# Altium project Mixed Signal Design Board.PrjPcb (part 1 of 2)
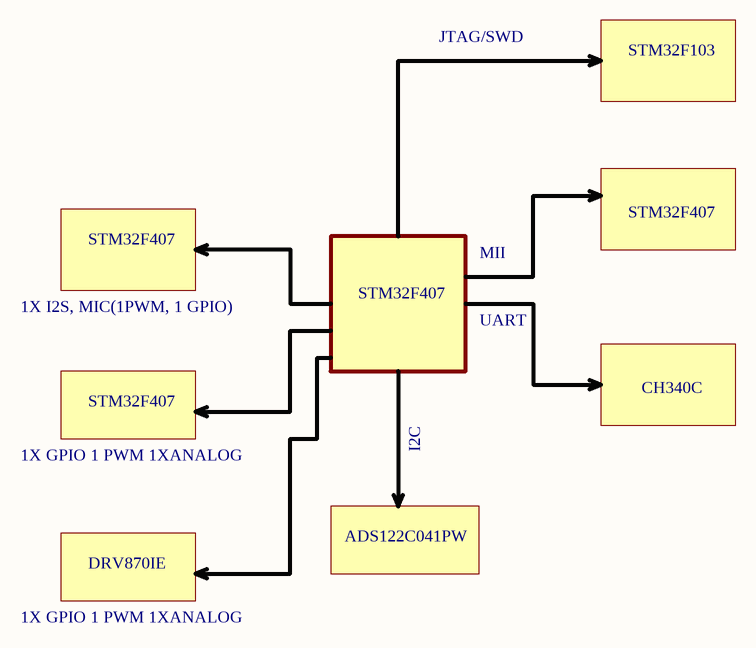
[diagram p0: Block Diagram.SchDoc]
11 sheets, 189 parts. Net scope: flat (ports and power ports of the same name join across sheets).
Board file: Mixed Signal Board.PcbDoc
Sheets:
  Block Diagram.SchDoc
  Power Budget.SchDoc
  STM32F103.SchDoc
  Ethernet PHY.SchDoc
  Motor Driver.SchDoc
  UART to TTL.SchDoc
  ADC.SchDoc
  DAC_MIC.SchDoc
  Motor Driver_2.SchDoc
  STM32F407.SchDoc
  Power and Regulator.SchDoc

## Sheet Block Diagram.SchDoc: Mixed Signal Board Design
size A4; Author: Nilay Nandimath; DrawnBy: Nilay Nandimath; Engineer: Nilay Nandimath; Organization: -; Address1: -; Address2: -; Address3: -; Address4: -; DocumentNumber: 1; Revision: 1; SheetNumber: 1; SheetTotal: 11; Title2: -; Project: -; ENG_APP_DATE: -; DSN_APP_DATE: -; CHK_APP_DATE: -; ImagePath: -; Application_BuildNumber: -

### Notes on the sheet
- JTAG/SWD
- STM32F103
- STM32F407
- MII
- 1X I2S, MIC(1PWM, 1 GPIO)
- UART
- CH340C
- 1X GPIO 1 PWM 1XANALOG
- I2C
- DRV870IE
- ADS122C041PW
- DWG. NO.
- REV.
- SHT.
- THIS DOCUMENT AND THE DATA DISCLOSED HEREIN OR HEREWITH IS THE PROPERTY OF ALTIUM LIMITED AND MAY BE FREELY DISTRIBUTED IN WHOLE. NO RIGHTS ARE RESERVED OR EXPRESS OR IMPLIED WARANTEE GIVEN.
- REVISION
- DESCRIPTION
- DATE
- APPROVED
- ENG:
- APPROVALS
- PROJECT
- DSN:
- CHK:
- REFERENCE DOCUMENTS
- PROJECT REVISION:
- TITLE
- DOCUMENT REVISION:
- DESIGN ITEM:
- BOM:
- FAB DWG:
- PCB DWG:
- ASSY DWG:
- SCALE:
- SIZE
- B
- CAGE CODE
- FILE NAME
- DWG NO.
- SHEET
- OF
- REV

## Sheet Power Budget.SchDoc
size 431 x 279 mm; Organization: ORGANIZATION; Address1: ADDRESS 1; Address2: ADDRESS 2; Address3: ADDRESS 3; Address4: ADDRESS 4; Revision: -; ENG_APP_DATE: --/--/--; DSN_APP_DATE: --/--/--; CHK_APP_DATE: --/--/--
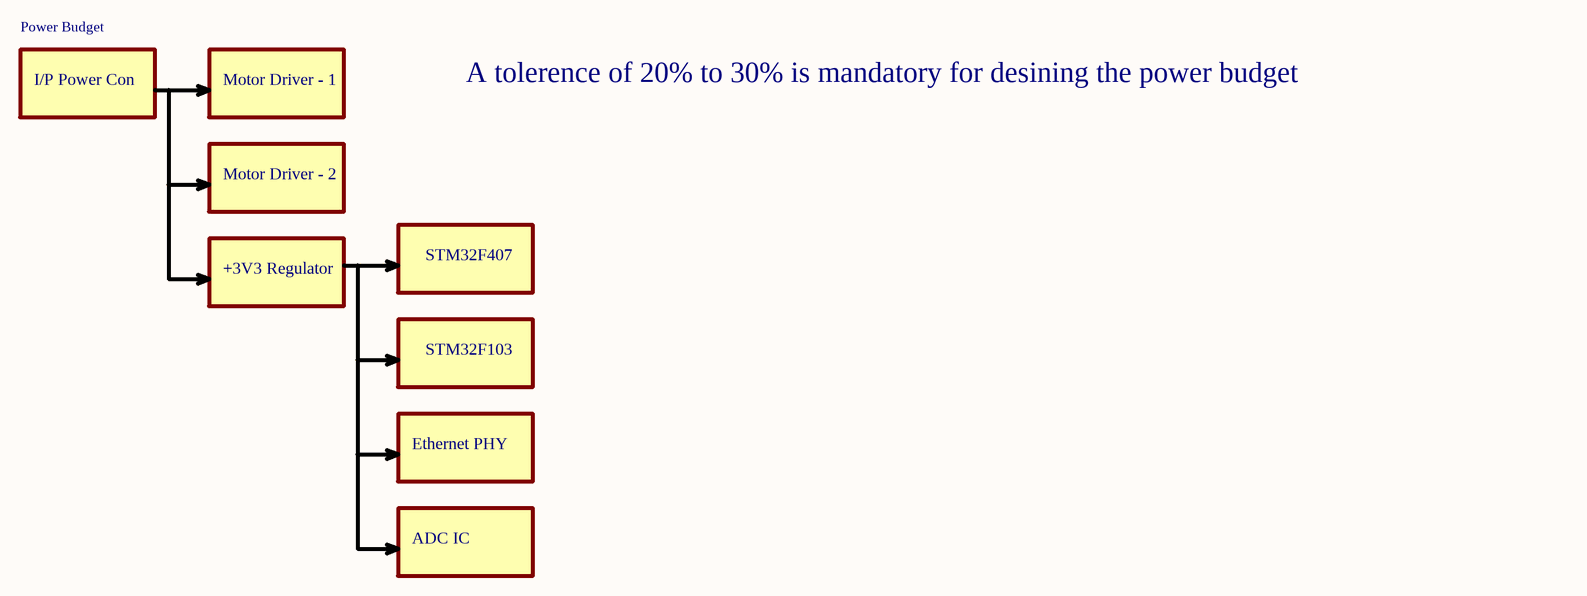
[diagram p1: Power Budget.SchDoc]

### Notes on the sheet
- Power Budget
- I/P Power Con
- Motor Driver - 1
- A tolerence of 20% to 30% is mandatory for desining the power budget
- Motor Driver - 2
- STM32F407
- +3V3 Regulator
- STM32F103
- Ethernet PHY
- ADC IC
- DWG. NO.
- REV.
- SHT.
- THIS DOCUMENT AND THE DATA DISCLOSED HEREIN OR HEREWITH IS THE PROPERTY OF ALTIUM LIMITED AND MAY BE FREELY DISTRIBUTED IN WHOLE. NO RIGHTS ARE RESERVED OR EXPRESS OR IMPLIED WARANTEE GIVEN.
- REVISION
- DESCRIPTION
- DATE
- APPROVED
- ENG:
- APPROVALS
- PROJECT
- DSN:
- CHK:
- REFERENCE DOCUMENTS
- PROJECT REVISION:
- TITLE
- DOCUMENT REVISION:
- DESIGN ITEM:
- BOM:
- FAB DWG:
- PCB DWG:
- ASSY DWG:
- SCALE:
- SIZE
- B
- CAGE CODE
- FILE NAME
- DWG NO.
- SHEET
- OF
- REV

## Sheet STM32F103.SchDoc
size A4; Organization: ORGANIZATION; Address1: ADDRESS 1; Address2: ADDRESS 2; Address3: ADDRESS 3; Address4: ADDRESS 4; Revision: -; SheetNumber: 3; SheetTotal: 11; ENG_APP_DATE: --/--/--; DSN_APP_DATE: --/--/--; CHK_APP_DATE: --/--/--
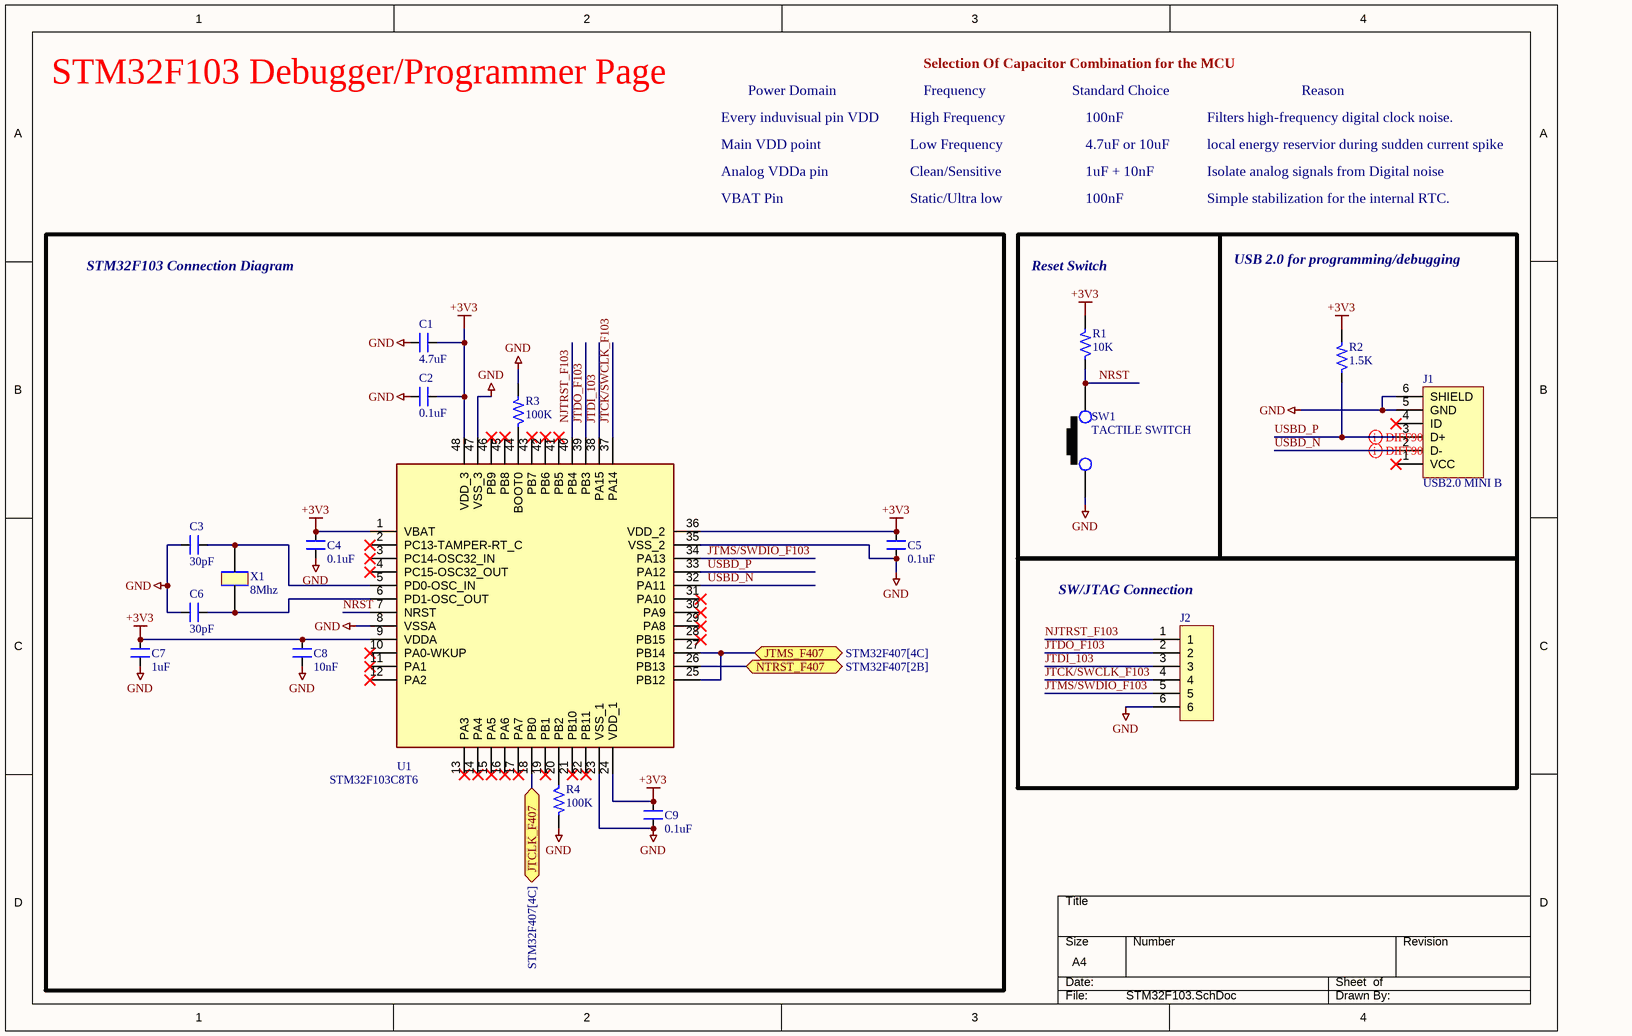
[diagram p2: STM32F103.SchDoc]

### Parts
C1  4.7uF  [CAP_0805]
C2  0.1uF  [CAP_0805]
C3  30pF  [CAP_0805]
C4  0.1uF  [CAP_0805]
C5  0.1uF  [CAP_0805]
C6  30pF  [CAP_0805]
C7  1uF  [CAP_0805]
C8  10nF  [CAP_0805]
C9  0.1uF  [CAP_0805]
J1  USB2.0 MINI B  [CON_690-005-299-043]
J2  Bergstrip 2.54mm  [CON6_100_59D78_TH_ST]  (value not drawn)
R1  10K  [RES_0805]
R2  1.5K  [RES_0805]
R3  100K  [RES_0603]
R4  100K  [RES_0603]
SW1  TACTILE SWITCH  [SW_342_SMD]
U1  STM32F103C8T6  [LQFP-48_19.6_393_58X11_SMD]
X1  8Mhz  [XTAL_314_240X47_SMD]

### Blocks framed on the sheet
STM32F103 Connection Diagram: C1-C9 R3 R4 U1 X1
Reset Switch: R1 SW1
USB 2.0 for programming/debugging: J1 R2
SW/JTAG Connection: J2

### Ports
JTCLK_F407 (bidir, see STM32F407[4C]), JTMS_F407 (bidir, see STM32F407[4C]), NTRST_F407 (bidir, see STM32F407[2B])

### Nets
+3V3: C1.2 C2.2 C4.2 C5.2 C7.2 C8.2 C9.2 R1.2 R2.2 U1.1(VBAT) U1.9(VDDA) U1.24(VDD_1) U1.36(VDD_2) U1.48(VDD_3)
GND: C1.1 C2.1 C3.2 C4.1 C5.1 C6.2 C7.1 C8.1 C9.1 J1.5(GND) J1.6(SHIELD) J2.6 R3.2 R4.2 SW1.1 U1.8(VSSA) U1.23(VSS_1) U1.35(VSS_2) U1.47(VSS_3)
JTCK/SWCLK_F103: J2.4 U1.37(PA14)
JTCLK_F407: U1.18(PB0) ; port JTCLK_F407
JTDI_103: J2.3 U1.38(PA15)
JTDO_F103: J2.2 U1.39(PB3)
JTMS/SWDIO_F103: J2.5 U1.34(PA13)
NJTRST_F103: J2.1 U1.40(PB4)
NRST: R1.1 SW1.2 U1.7(NRST)
NTRST_F407: U1.26(PB13) ; port NTRST_F407
USBD_N: J1.2(D-) U1.32(PA11)
USBD_P: J1.3(D+) R2.1 U1.33(PA12)
NetC3_1: C3.1 U1.5(PD0-OSC_IN) X1.2
NetC6_1: C6.1 U1.6(PD1-OSC_OUT) X1.1
NetR3_1: R3.1 U1.44(BOOT0)
NetR4_1: R4.1 U1.20(PB2)
NetU1_25: U1.25(PB12) U1.27(PB14) ; port JTMS_F407

Not connected (* = marked no-connect by the designer): J1 1(VCC)* 4(ID)*; U1 2(PC13-TAMPER-RT_C)* 3(PC14-OSC32_IN)* 4(PC15-OSC32_OUT)* 10(PA0-WKUP)* 11(PA1)* 12(PA2)* 13(PA3)* 14(PA4)* 15(PA5)* 16(PA6)* 17(PA7)* 19(PB1)* 21(PB10)* 22(PB11)* 28(PB15)* 29(PA8)* 30(PA9)* 31(PA10)* 41(PB5)* 42(PB6)* 43(PB7)* 45(PB8)* 46(PB9)*

### Layout directives
differential pair; differential pair class DIFF90: USBD_N, USBD_P

### Notes on the sheet
- STM32F103 Debugger/Programmer Page
- Power Domain
- Selection Of Capacitor Combination for the MCU
- Frequency
- Standard Choice
- Reason
- Every induvisual pin VDD
- Main VDD point
- Analog VDDa pin
- High Frequency
- Low Frequency
- Clean/Sensitive
- 100nF
- 4.7uF or 10uF
- 1uF + 10nF
- Filters high-frequency digital clock noise.
- local energy reservior during sudden current spike
- Isolate analog signals from Digital noise
- VBAT Pin
- Static/Ultra low
- Simple stabilization for the internal RTC.
- DWG. NO.
- REV.
- SHT.
- THIS DOCUMENT AND THE DATA DISCLOSED HEREIN OR HEREWITH IS THE PROPERTY OF ALTIUM LIMITED AND MAY BE FREELY DISTRIBUTED IN WHOLE. NO RIGHTS ARE RESERVED OR EXPRESS OR IMPLIED WARANTEE GIVEN.
- REVISION
- DESCRIPTION
- DATE
- APPROVED
- ENG:
- APPROVALS
- PROJECT
- DSN:
- CHK:
- REFERENCE DOCUMENTS
- PROJECT REVISION:
- TITLE
- DOCUMENT REVISION:
- DESIGN ITEM:
- BOM:
- FAB DWG:
- PCB DWG:
- ASSY DWG:
- SCALE:
- SIZE
- B
- CAGE CODE
- FILE NAME
- DWG NO.
- SHEET
- OF
- REV

### Library data of the parts
C1 = CAP_4.7uF-50V-10%-0805: 4.7µF ±10% 50V Ceramic Capacitor X5R 0805 (2012 Metric); Manufacturer: Yageo; Manufacturer Part Number: GRM21BR61H475KE51L; Alternate Part Number-1: NA; Case/Package: 0805; Supplier-1: SIRICOM; Supplier Part Number-1: CL21A475KBQNNNE
C2 C4 C5 C9 = CAP_0.1uF-50V-10%-0805: 0.1µF ±10% 50V Ceramic Capacitor X7R 0805 (2012 Metric); Manufacturer: Samsung; Manufacturer Part Number: CL21B104KBCNNNC; Alternate Part Number-1: NA; Case/Package: 0805; Supplier-1: SIRICOM; Supplier Part Number-1: 0805B104K500CT
C3 C6 = CAP_30pF-50V-10%-0805: ±10% 50V Ceramic Capacitor C0G, NP0 0805 (2012 Metric); Manufacturer Part Number: C0805C300K5GAC7800; Manufacturer: KEMET; Alternate Part Number: NA; Case/Package: 0805; Supplier-1: Digikey; Supplier Part Number-1: 399-17443-1-ND - Cut Tape (CT)
C7 = CAP_1uF-50V-5%-0805: 1µF ±5% 50V Ceramic Capacitor X7R 0805 (2012 Metric); Manufacturer: Samsung; Manufacturer Part Number: CC0805JKX7R9BB105; Alternate Part Number-1: 0805F105M500NT; Case/Package: 0805; Supplier-1: SIRICOM; Supplier Part Number-1: CL21B105KBFNNNE
C8 = CAP_10nF-50V-10%-0805: 10000pF ±10% 50V Ceramic Capacitor X7R 0805 (2012 Metric); Manufacturer: Samsung; Manufacturer Part Number: C0805C103K5RECAUTO; Alternate Part Number-1: GRM2195C1H103JA01D; Case/Package: 0805; Supplier-1: SIRICOM; Supplier Part Number-1: 0805B103K500CT
J1 = CON_USB2.0-MINIB-SMD: USB - mini B USB 2.0 Receptacle Connector 5 Position Surface Mount, Right Angle; Manufacturer: EDAC; Manufacturer Part Number: 690-005-299-043; Alternate Part Number-1: NA; Case/Package: USB-MINI-B; Supplier-1: LCSC; Supplier Part Number-1: C105424
J2 = CON-BS-SKT_6X1-100-ST-TH: 6 Pins, 1 Row 2.54mm Pitch, Straight bergstrip, Female; Manufacturer: Molex; Alternate Part Number-1: NA; Manufacturer Part Number: 22-10-2061; Case/Package: TH-CON; Supplier-1: SP ROAD; Supplier Part Number-1: NA
R1 = RES_10K-0.125W-1%-0805: 10 kOhms ±1% 0.125W, 1/8W Chip Resistor 0805 (2012 Metric) Automotive AEC-Q200 Thick Film; Manufacturer: CTS; Manufacturer Part Number: WR08X1002FTL; Case/Package: 0805; Supplier-1: SIRICOM; Supplier Part Number-1: WR08X1002FTL; Alternate Part Number-1: WR08X1002FTL
R2 = RES_1.5K-0.125W-1%-0805: 1.5 kOhms ±1% 0.125W, 1/8W Chip Resistor 0805 (2012 Metric) Thick Film; Manufacturer: TE Connectivity Passive Product; Manufacturer Part Number: CRG0805F1K5; Alternate Part Number-1: NA; Case/Package: 0805; Supplier-1: SIRICOM; Supplier Part Number-1: NA
R3 R4 = RES_100K-0.1W-1%-0603: 100 kOhms ±1% 0.1W, 1/10W Chip Resistor 0603 (1608 Metric) Automotive AEC-Q200 Thick Film; Manufacturer: Stackpole Electronics; Manufacturer Part Number: RMCF0603FT100K; Alternate Part Number-1: NA; Case/Package: 0603; Supplier-1: Arrow; Supplier Part Number-1: RMCF0603FT100K
SW1 = SW1_RS-282G05A3-SMRT-SMD: Tactile Switch SPST-NO Top Actuated Surface Mount; Manufacturer: ITT C&K; Alternate Part Number-1: NA; Manufacturer Part Number: RS-282G05A3-SMRT; Case/Package: SMD; Supplier-1: SP ROAD; Supplier Part Number-1: RS-282G05A3-SMRT
U1 = IC_STM32F103C8T6: ARM® Cortex®-M3 STM32F1 Microcontroller IC 32-Bit 72MHz 64KB (64K x 8) FLASH 48-LQFP (7x7); Manufacturer: STMicroelectronics; Alternate Part Number-1: NA; Manufacturer Part Number: STM32F103C8T6; Case/Package: LQFP48; Supplier-1: LCSC; Supplier Part Number-1: STM32F103C8T6
X1 = XTAL_8MHZ-ECS-80-32-5PX-SMD: 8MHz ±30ppm Crystal 32pF 60 Ohms HC-49/US; Manufacturer: Fox Electronics; Manufacturer Part Number: ECS-80-32-5PX-TR; Alternate Part Number-1: NA; Case/Package: SMD/SMT; Supplier-1: SP ROAD; Supplier Part Number-1: ECS-80-32-5PX-TR

## Sheet Ethernet PHY.SchDoc
size A4; Organization: ORGANIZATION; Address1: ADDRESS 1; Address2: ADDRESS 2; Address3: ADDRESS 3; Address4: ADDRESS 4; Revision: -; SheetNumber: 4; SheetTotal: 11; ENG_APP_DATE: --/--/--; DSN_APP_DATE: --/--/--; CHK_APP_DATE: --/--/--
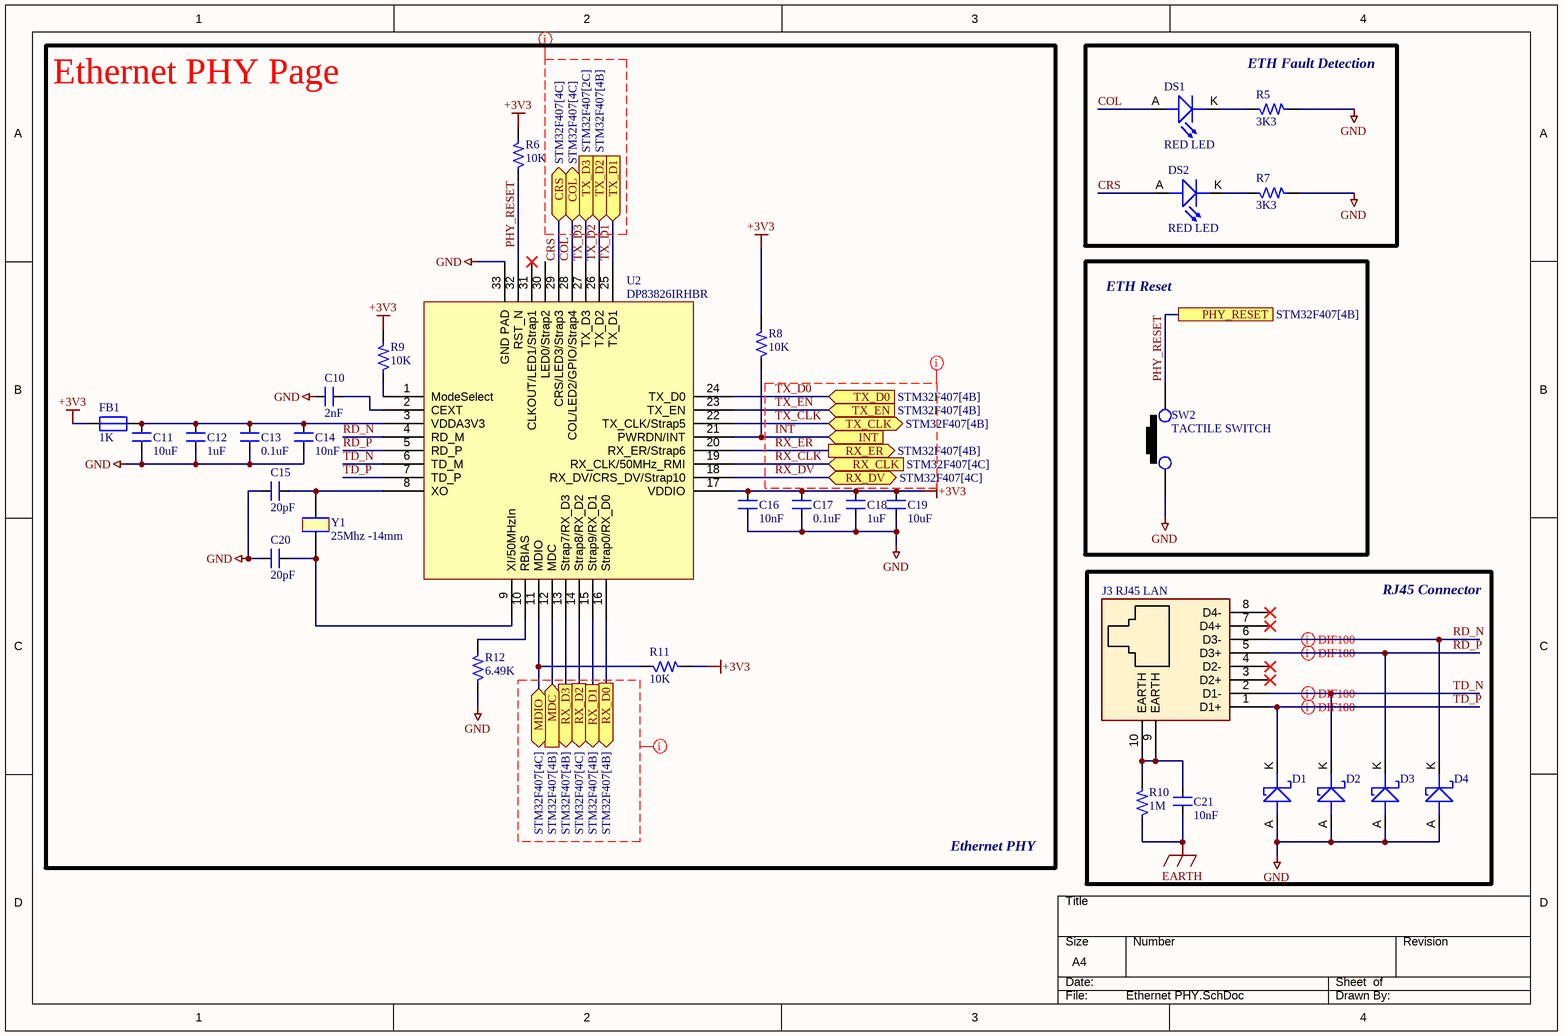
[diagram p3: Ethernet PHY.SchDoc]

### Parts
C10  2nF  [CAP_0805]
C11  10uF  [CAP_1206]
C12  1uF  [CAP_0805]
C13  0.1uF  [CAP_0805]
C14  10nF  [CAP_0805]
C15  20pF  [CAP_0805]
C16  10nF  [CAP_0805]
C17  0.1uF  [CAP_0805]
C18  1uF  [CAP_0805]
C19  10uF  [CAP_1206]
C20  20pF  [CAP_0805]
C21  10nF  [CAP_P196_102X287_H332_RAD_TH]
D1  ESD3V3D9-TP  [DIO_SOD-923]  (value not drawn)
D2  ESD3V3D9-TP  [DIO_SOD-923]  (value not drawn)
D3  ESD3V3D9-TP  [DIO_SOD-923]  (value not drawn)
D4  ESD3V3D9-TP  [DIO_SOD-923]  (value not drawn)
DS1  RED LED  [LED_0805]
DS2  RED LED  [LED_0805]
FB1  1K  [IND_0805]
J3  RJ45 LAN  [CON10_P106_RJ45_TH_ST]
R5  3K3  [RES_0603]
R6  10K  [RES_0805]
R7  3K3  [RES_0603]
R8  10K  [RES_0603]
R9  10K  [RES_0805]
R10  1M  [RES_0805]
R11  10K  [RES_0805]
R12  6.49K  [RES_0805]
SW2  TACTILE SWITCH  [SW_342_SMD]
U2  DP83826IRHBR  [VQFN32_19_218_23X9_SMD]
Y1  25Mhz -14mm  [XTAL_314_240X47_SMD]

### Blocks framed on the sheet
Ethernet PHY Page: C10-C20 FB1 R6 R8 R9 R11 R12 U2 Y1
ETH Fault Detection: DS1 DS2 R5 R7
ETH Reset: SW2
RJ45 Connector: C21 D1-D4 J3 R10

### Ports
COL (bidir, see STM32F407[4C]), CRS (bidir, see STM32F407[4C]), INT (in), MDC (in, see STM32F407[4B]), MDIO (bidir, see STM32F407[4C]), PHY_RESET (see STM32F407[4B]), RX_CLK (in, see STM32F407[4C]), RX_D0 (out, see STM32F407[4B]), RX_D1 (out, see STM32F407[4B]), RX_D2 (out, see STM32F407[4C]), RX_D3 (out, see STM32F407[4B]), RX_DV (bidir, see STM32F407[4C]), RX_ER (out, see STM32F407[4B]), TX_CLK (bidir, see STM32F407[4B]), TX_D0 (in, see STM32F407[4B]), TX_D1 (in), TX_D2 (in, see STM32F407[4B]), TX_D3 (in, see STM32F407[2C]), TX_EN (in, see STM32F407[4B])

### Nets
+3V3: C16.2 C17.2 C18.2 C19.2 FB1.1 R6.2 R8.2 R9.2 R11.2 U2.17(VDDIO)
EARTH: C21.1 R10.1
GND: C10.1 C11.1 C12.1 C13.1 C14.1 C15.1 C16.1 C17.1 C18.1 C19.1 C20.1 D1.A D2.A D3.A D4.A R5.2 R7.2 R12.1 SW2.1 U2.33(GND_PAD)
COL: DS1.A(ANODE) U2.28(COL/LED2/GPIO/Strap4) ; port COL
CRS: DS2.A(ANODE) U2.29(CRS/LED3/Strap3) ; port CRS
INT: R8.1 U2.21(PWRDN/INT) ; port INT
MDC: U2.12(MDC) ; port MDC
MDIO: R11.1 U2.11(MDIO) ; port MDIO
PHY_RESET: R6.1 SW2.2 U2.32(RST_N) ; port PHY_RESET
RD_N: D4.K J3.6(D3-) U2.4(RD_M)
RD_P: D3.K J3.5(D3+) U2.5(RD_P)
RX_CLK: U2.19(RX_CLK/50MHz_RMI) ; port RX_CLK
RX_D0: U2.16(Strap0/RX_D0) ; port RX_D0
RX_D1: U2.15(Strap9/RX_D1) ; port RX_D1
RX_D2: U2.14(Strap8/RX_D2) ; port RX_D2
RX_D3: U2.13(Strap7/RX_D3) ; port RX_D3
RX_DV: U2.18(RX_DV/CRS_DV/Strap10) ; port RX_DV
RX_ER: U2.20(RX_ER/Strap6) ; port RX_ER
TD_N: D2.K J3.2(D1-) U2.6(TD_M)
TD_P: D1.K J3.1(D1+) U2.7(TD_P)
TX_CLK: U2.22(TX_CLK/Strap5) ; port TX_CLK
TX_D0: U2.24(TX_D0) ; port TX_D0
TX_D1: U2.25(TX_D1) ; port TX_D1
TX_D2: U2.26(TX_D2) ; port TX_D2
TX_D3: U2.27(TX_D3) ; port TX_D3
TX_EN: U2.23(TX_EN) ; port TX_EN
NetC10_2: C10.2 U2.2(CEXT)
NetC11_2: C11.2 C12.2 C13.2 C14.2 FB1.2 U2.3(VDDA3V3)
NetC15_2: C15.2 U2.8(XO) Y1.2
NetC20_2: C20.2 U2.9(XI/50MHzIn) Y1.1
NetC21_2: C21.2 J3.9(EARTH) J3.10(EARTH) R10.2
NetDS1_K: DS1.K(CATHODE) R5.1
NetDS2_K: DS2.K(CATHODE) R7.1
NetR9_1: R9.1 U2.1(ModeSelect)
NetR12_2: R12.2 U2.10(RBIAS)

Not connected (* = marked no-connect by the designer): J3 3(D2+)* 4(D2-)* 7(D4+)* 8(D4-)*; U2 30(LED0/Strap2) 31(CLKOUT/LED1/Strap1)*

### Layout directives
net class 50OHM: (no net found under the mark), INT, RX_CLK, RX_DV, RX_ER, TX_CLK, TX_D0, TX_EN
differential pair; differential pair class DIF100: RD_N, RD_P, TD_N, TD_P

### Notes on the sheet
- Ethernet PHY
- DWG. NO.
- REV.
- SHT.
- THIS DOCUMENT AND THE DATA DISCLOSED HEREIN OR HEREWITH IS THE PROPERTY OF ALTIUM LIMITED AND MAY BE FREELY DISTRIBUTED IN WHOLE. NO RIGHTS ARE RESERVED OR EXPRESS OR IMPLIED WARANTEE GIVEN.
- REVISION
- DESCRIPTION
- DATE
- APPROVED
- ENG:
- APPROVALS
- PROJECT
- DSN:
- CHK:
- REFERENCE DOCUMENTS
- PROJECT REVISION:
- TITLE
- DOCUMENT REVISION:
- DESIGN ITEM:
- BOM:
- FAB DWG:
- PCB DWG:
- ASSY DWG:
- SCALE:
- SIZE
- B
- CAGE CODE
- FILE NAME
- DWG NO.
- SHEET
- OF
- REV

### Library data of the parts
C10 = CAP_2nF-50V-10%-0805: 2000pF ±10% 50V Ceramic Capacitor X7R 0805 (2012 Metric); Manufacturer: Samsung Electro-Mechanics; Manufacturer Part Number: CL21B202KBANNNC; Alternate Part Number-1: NA; Case/Package: 0805; Supplier-1: Digikey; Supplier Part Number-1: 1276-2471-1-ND - Cut Tape (CT)
C11 C19 = CAP_10uF-50V-10%-1206: 10µF ±10% 50V Ceramic Capacitor X7R 1206 (3216 Metric); Manufacturer: KEMET; Manufacturer Part Number: CL31B106KBHNNNE; Alternate Part Number-1: GRT31CR61H106ME01L; Case/Package: 1206; Supplier-1: SIRICOM; Supplier Part Number-1: CC1206KKX5R9BB106
C12 C18 = CAP_1uF-50V-5%-0805: as C7 on sheet STM32F103; Case/Package: 0805; Supplier-1: SIRICOM; Supplier Part Number-1: CL21B105KBFNNNE
C13 C17 = CAP_0.1uF-50V-5%-0805: 0.1µF ±5% 50V Ceramic Capacitor X7R 0805 (2012 Metric); Manufacturer: AVX Corporation; Manufacturer Part Number: 08055C104JAT4A; Alternate Part Number-1: 0805B104M500; Case/Package: 0805; Supplier-1: SIRICOM; Supplier Part Number-1: 0805B104J500CT
C14 C16 = CAP_10nF-50V-10%-0805: as C8 on sheet STM32F103; Case/Package: 0805; Supplier-1: SIRICOM; Supplier Part Number-1: 0805B103K500CT
C15 C20 = CAP_20pF-50V-10%-0805: ±10% 50V Ceramic Capacitor C0G, NP0 0805 (2012 Metric); Manufacturer: AVX Corporation; Manufacturer Part Number: 08055A200KAT2A; Alternate Part Number-1: NA; Case/Package: 0805; Supplier-1: Digikey; Supplier Part Number-1: 478-11887-1-ND - Cut Tape (CT)
C21 = CAP_10nF-1KV-10%-RAD-TH: 10000pF ±10% 1000V (1kV) Ceramic Capacitor X7R Radial; Manufacturer: Yageo; Manufacturer Part Number: RDER73A103K2K1H03B; Alternate Part Number-1: NA; Case/Package: TH; Supplier-1: SP ROAD; Supplier Part Number-1: RDER73A103K2K1H03B
D1-D4 = DIO-T_3.3V-8.8V-SOD923: 8.8V Clamp 5A (8/20µs) Ipp Tvs Diode Surface Mount SOD-923; Manufacturer: Micro Commercial Co; Alternate Part Number-1: NA; Manufacturer Part Number: ESD3V3D9-TP; Case/Package: SOD923; Supplier-1: Digikey; Supplier Part Number-1: ESD3V3D9-TPMSCT-ND - Cut Tape (CT)
DS1 DS2 = LED_RED-2V-20mA-0805: Red 631nm LED Indication - Discrete 2V 0805 (2012 Metric); Manufacturer: Vishay Lite-On; Manufacturer Part Number: LTST-C171KRKT; Alternate Part Number-1: NA; Case/Package: 0805; Supplier-1: SP ROAD; Supplier Part Number-1: LTST-C171KRKT
FB1 = FB_1K-100MHZ-1.6A-0805: 1 kOhms @ 100MHz 1 Power Line Ferrite Bead 0805 (2012 Metric) 1.6A; Manufacturer: Laird; Manufacturer Part Number: BLM21SP102SH1D; Alternate Part Number-1: NA; Case/Package: 0805; Supplier-1: SIRICOM; Supplier Part Number-1: ACMS201209A102
J3 = CON-SKT-RJ_8C8P-RA-TH: 8 Pins, 2 Row 2.54mm Pitch, right angle Connector, male; Manufacturer: Assmann; Manufacturer Part Number: A-2004-2-4-LPS-N-R; Alternate Part Number-1: NA; Case/Package: TH-CON; Supplier-1: SP ROAD; Supplier Part Number-1: A-2004-2-4-LPS-N-R
R5 R7 = RES_3.3K-0.1W-1%-0603: 3.3 kOhms ±1% 0.1W, 1/10W Chip Resistor 0603 (1608 Metric) Automotive AEC-Q200 Thick Film; Manufacturer: Wilson; Manufacturer Part Number: WR06X3301FTL; Alternate Part Number-1: 0603WAF3301T5E; Case/Package: 0603; Supplier-1: SIRICOM; Supplier Part Number-1: WR06X3301FTL
R6 R9 R11 = RES_10K-0.125W-1%-0805: as R1 on sheet STM32F103; Case/Package: 0805; Supplier-1: SIRICOM; Supplier Part Number-1: WR08X1002FTL; Alternate Part Number-1: WR08X1002FTL
R8 = RES_10K-0.1W-1%-0603: 10 kOhms ±1% 0.1W, 1/10W Chip Resistor 0603 (1608 Metric) Automotive AEC-Q200 Thick Film; Manufacturer: Walsin; Manufacturer Part Number: WR06X1002FTL; Alternate Part Number-1: 0603WAJ0103T5E; Case/Package: 0603; Supplier-1: SIRICOM; Supplier Part Number-1: WR06X1002FTL
R10 = RES_1M-0.125W-1%-0805: 1 MOhms ±1% 0.125W, 1/8W Chip Resistor 0805 (2012 Metric) Automotive AEC-Q200 Thick Film; Manufacturer: Walsin; Manufacturer Part Number: WR08X1004FTL; Alternate Part Number-1: 0805W8F1004T5E; Case/Package: 0805; Supplier-1: SIRICOM; Supplier Part Number-1: WR08X1004FTL
R12 = RES_6.49K-0.125W-1%-0805: 6.49 kOhms ±1% 0.125W, 1/8W Chip Resistor 0805 (2012 Metric) Moisture Resistant Thick Film; Manufacturer: Stackpole Electronics; Manufacturer Part Number: RC0805FR-076K49L; Alternate Part Number-1: NA; Case/Package: 0805; Supplier-1: SIRICOM; Supplier Part Number-1: WRO8X6491FTL
SW2 = SW1_RS-282G05A3-SMRT-SMD: as SW1 on sheet STM32F103; Manufacturer Part Number: RS-282G05A3-SMRT; Case/Package: SMD; Supplier-1: SP ROAD; Supplier Part Number-1: RS-282G05A3-SMRT
U2 = IC_DP83826IRHBR: Ethernet ICs Low latency 10/100-Mbps PHY, MII interface and enhanced mode with an industrial temperature range 32-VQFN -40 to 85; Manufacturer: Texas Instruments; Alternate Part Number-1: NA; Manufacturer Part Number: DP83826IRHBR; Case/Package: 32-VQFN; Supplier-1: Mouser; Supplier Part Number-1: 595-DP83826IRHBR
Y1 = XTAL_25Mhz-FOXSDLF/250F-20: 25MHz ±30ppm Crystal 20pF 30 Ohms HC-49/US; Manufacturer: Abracon; Alternate Part Number-1: NA; Manufacturer Part Number: FOXSDLF/250F-20; Case/Package: SMD; Supplier-1: MOUSER; Supplier Part Number-1: FOXSDLF/250F-20

## Sheet Motor Driver.SchDoc
size A4; Organization: ORGANIZATION; Address1: ADDRESS 1; Address2: ADDRESS 2; Address3: ADDRESS 3; Address4: ADDRESS 4; Revision: -; SheetNumber: 5; SheetTotal: 11; ENG_APP_DATE: --/--/--; DSN_APP_DATE: --/--/--; CHK_APP_DATE: --/--/--
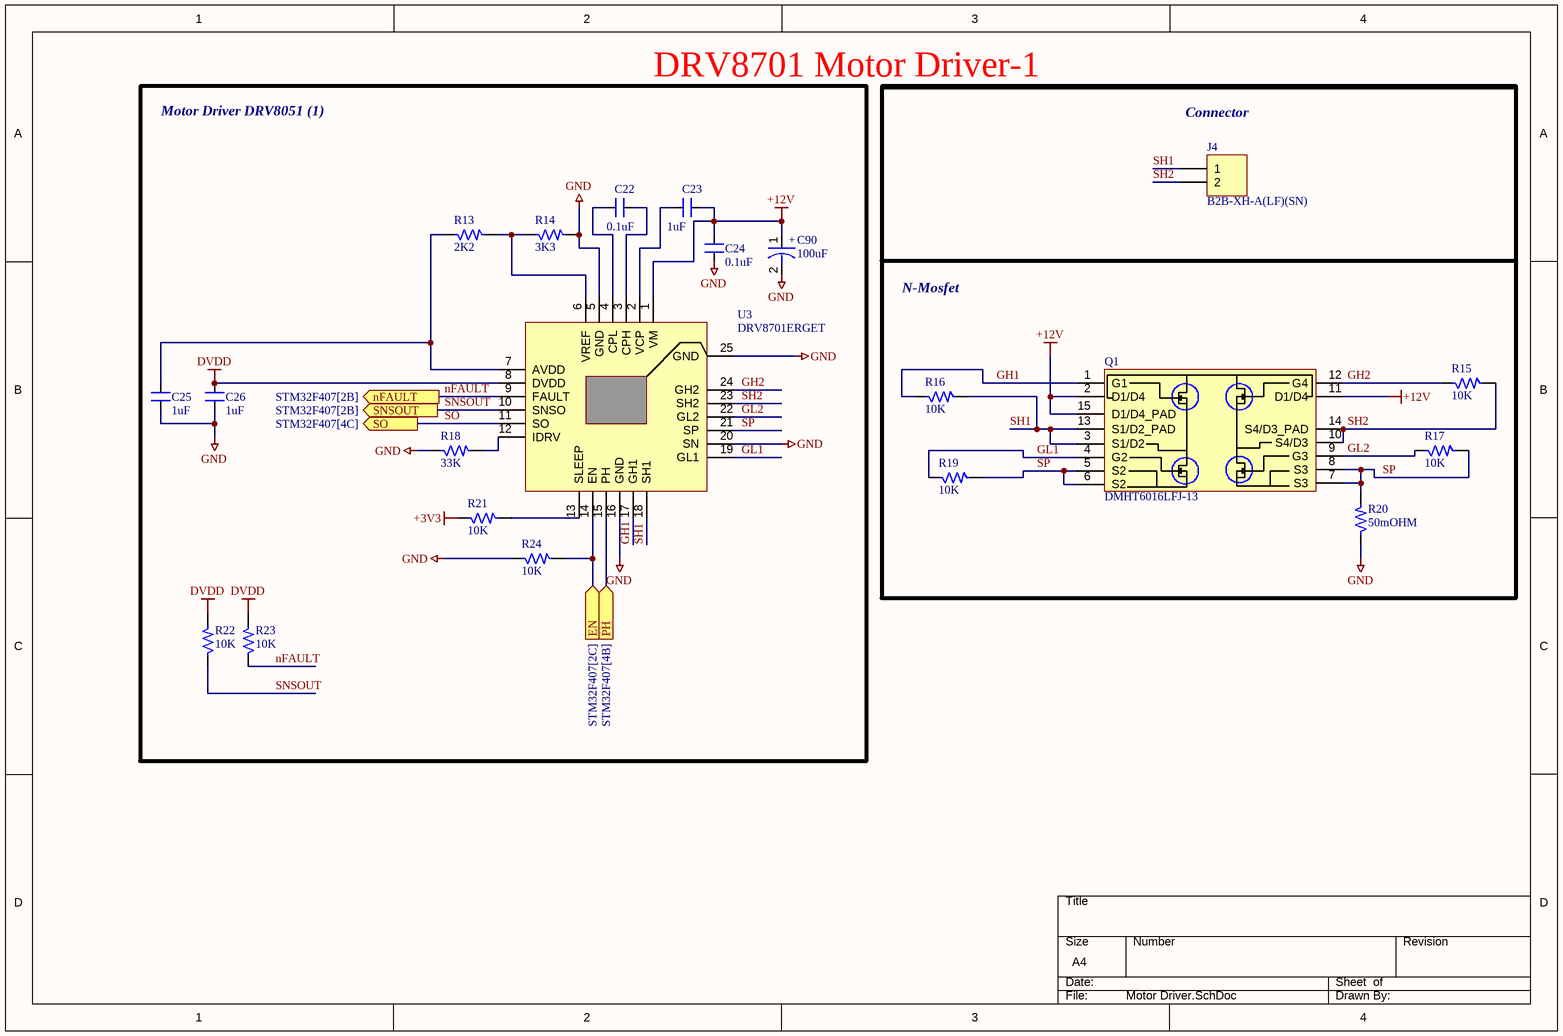
[diagram p4: Motor Driver.SchDoc]

### Parts
C22  0.1uF  [CAP_0805]
C23  1uF  [CAP_0805]
C24  0.1uF  [CAP_0805]
C25  1uF  [CAP_0805]
C26  1uF  [CAP_0805]
C90  100uF  [ACAP_P305_D393_H393_RAD]
J4  B2B-XH-A(LF)(SN)  [CON2_100_B2B-XH-A_TH_ST]
Q1  DMHT6016LFJ-13  [DFN5045-12_33_212_27X15_SMD_1]
R13  2K2  [RES_0603]
R14  3K3  [RES_0603]
R15  10K  [RES_0603]
R16  10K  [RES_0603]
R17  10K  [RES_0603]
R18  33K  [RES_0805]
R19  10K  [RES_0603]
R20  50mOHM  [RES_2512]
R21  10K  [RES_0603]
R22  10K  [RES_0603]
R23  10K  [RES_0603]
R24  10K  [RES_0603]
U3  DRV8701ERGET  [VFQFN24_19.6_196_12X32_SMD_1]

### Blocks framed on the sheet
DRV8701 Motor Driver-1: C22-C26 C90 R13 R14 R18 R21-R24 U3
N-Mosfet: Q1 R15-R17 R19 R20
Connector: J4

### Ports
EN (in, see STM32F407[2C]), nFAULT (out, see STM32F407[2B]), PH (in, see STM32F407[4B]), SNSOUT (out, see STM32F407[2B]), SO (out, see STM32F407[4C])

### Nets
+3V3: R21.1
+12V: C23.2 C24.2 C90.1 Q1.2(D1/D4) Q1.11(D1/D4) Q1.15(D1/D4_PAD) U3.1(VM)
DVDD: C26.2 R22.2 R23.2 U3.8(DVDD)
GND: C24.1 C25.1 C26.1 C90.2 R14.2 R18.1 R20.1 R24.1 U3.5(GND) U3.16(GND) U3.20(SN) U3.25(GND)
EN: R24.2 U3.14(EN) ; port EN
GH1: Q1.1(G1) R16.1 U3.17(GH1)
GH2: Q1.12(G4) R15.1 U3.24(GH2)
GL1: Q1.4(G2) R19.1 U3.19(GL1)
GL2: Q1.9(G3) R17.1 U3.22(GL2)
nFAULT: R23.1 U3.9(FAULT) ; port nFAULT
PH: U3.15(PH) ; port PH
SH1: J4.1 Q1.3(S1/D2) Q1.13(S1/D2_PAD) R16.2 U3.18(SH1)
SH2: J4.2 Q1.10(S4/D3) Q1.14(S4/D3_PAD) R15.2 U3.23(SH2)
SNSOUT: R22.1 U3.10(SNSO) ; port SNSOUT
SO: U3.11(SO) ; port SO
SP: Q1.5(S2) Q1.6(S2) Q1.7(S3) Q1.8(S3) R17.2 R19.2 R20.2 U3.21(SP)
NetC22_1: C22.1 U3.3(CPH)
NetC22_2: C22.2 U3.4(CPL)
NetC23_1: C23.1 U3.2(VCP)
NetC25_2: C25.2 R13.1 U3.7(AVDD)
NetR13_2: R13.2 R14.1 U3.6(VREF)
NetR18_2: R18.2 U3.12(IDRV)
NetR21_2: R21.2 U3.13(SLEEP)

### Notes on the sheet
- Motor Driver DRV8051 (1)
- DWG. NO.
- REV.
- SHT.
- THIS DOCUMENT AND THE DATA DISCLOSED HEREIN OR HEREWITH IS THE PROPERTY OF ALTIUM LIMITED AND MAY BE FREELY DISTRIBUTED IN WHOLE. NO RIGHTS ARE RESERVED OR EXPRESS OR IMPLIED WARANTEE GIVEN.
- REVISION
- DESCRIPTION
- DATE
- APPROVED
- ENG:
- APPROVALS
- PROJECT
- DSN:
- CHK:
- REFERENCE DOCUMENTS
- PROJECT REVISION:
- TITLE
- DOCUMENT REVISION:
- DESIGN ITEM:
- BOM:
- FAB DWG:
- PCB DWG:
- ASSY DWG:
- SCALE:
- SIZE
- B
- CAGE CODE
- FILE NAME
- DWG NO.
- SHEET
- OF
- REV
- (in symbol CAP-P_100uF-50V-20%-RAD) +

### Library data of the parts
C22 C24 = CAP_0.1uF-50V-5%-0805: as C13 on sheet Ethernet PHY; Case/Package: 0805; Supplier-1: SIRICOM; Supplier Part Number-1: 0805B104J500CT
C23 C25 C26 = CAP_1uF-50V-5%-0805: as C7 on sheet STM32F103; Case/Package: 0805; Supplier-1: SIRICOM; Supplier Part Number-1: CL21B105KBFNNNE
C90 = CAP-P_100uF-50V-20%-RAD: 100µF 50V Aluminum Polymer Capacitor Radial, Can - SMD 28mOhm 4000 Hrs @ 125°C; Manufacturer: Nichicon; Manufacturer Part Number: GYA1H101MCQ1GS; Alternate Part Number-1: VEU101M1HTR-1010; Case/Package: Radial-SMD; Supplier-1: SP ROAD; Supplier Part Number-1: GYA1H101MCQ1GS
J4 = CON-PLG_2X1-100-ST-TH: 2 Pins, 1 Row 2.54mm Pitch, Straight Connector, male; Manufacturer: JST; Mating Part Number: XHP-2; Crimp Part Number: ASXHSXH22K51; Alternate Part Number-1: NA; Manufacturer Part Number: B2B-XH-A(LF)(SN); Case/Package: TH-CON; Supplier-1: SP ROAD; Supplier Part Number-1: B2B-XH-A(LF)(SN)
Q1 = MOSFET-N_60V-14.8A-V-DFN5045-12: Mosfet Array 4 N-Channel 14.8A (Ta) Surface Mount V-DFN5045-12; Manufacturer: ON Semiconductor; Alternate Part Number-1: DMHT3006LFJ-13; Manufacturer Part Number: DMHT6016LFJ-13; Case/Package: DFN5045-12; Supplier-1: LCSC; Supplier Part Number-1: C460986
R13 = RES_2K2-0.1W-5%-0603: 2.2 kOhms ±5% 0.1W, 1/10W Chip Resistor 0603 (1608 Metric) Automotive AEC-Q200 Thick Film; Manufacturer: Stackpole Electronics; Manufacturer Part Number: ERJ-3GEYJ222V; Alternate Part Number-1: WR06X2201FTL; Case/Package: 0603; Supplier-1: SIRICOM; Supplier Part Number-1: WR06X2201FTL
R14 = RES_3.3K-0.1W-1%-0603: as R5 on sheet Ethernet PHY; Case/Package: 0603; Supplier-1: SIRICOM; Supplier Part Number-1: WR06X3301FTL
R15-R17 R19 R21-R24 = RES_10K-0.1W-1%-0603: as R8 on sheet Ethernet PHY; Case/Package: 0603; Supplier-1: SIRICOM; Supplier Part Number-1: WR06X1002FTL
R18 = RES_33K-0.125W-1%-0805: Thick Film Resistors - SMD 33KOhms 1/8W 150V33 kOhms ±1% 0.125W, 1/8W Chip Resistor 0805 (2012 Metric) Thick Film; Manufacturer: Vishay BCcomponents; Manufacturer Part Number: CRG0805F33K; Alternate Part Number-1: NA; Case/Package: 0805; Supplier-1: SIRICOM; Supplier Part Number-1: WR08X3302FTL
R20 = RES_50mOhm-2W-1%-2512: 50 mOhms ±1% 2W Chip Resistor 2512 (6432 Metric) Automotive AEC-Q200, Current Sense, Moisture Resistant Metal Element; Manufacturer: Yageo; Manufacturer Part Number: PA2512FKF7W0R05E; Alternate Part Number-1: PMR100HZPFU5L00; Case/Package: 2512; Supplier-1: SIRICOM; Supplier Part Number-1: LR2512-22R060F1
U3 = IC_DRV8701ERGET: Motor Driver Power MOSFET Parallel 24-VQFN (4x4); Manufacturer: Texas Instruments; Alternate Part Number-1: NA; Manufacturer Part Number: DRV8701ERGET; Case/Package: VFQFN24; Supplier-1: ARROW; Supplier Part Number-1: DRV8701ERGET

## Sheet UART to TTL.SchDoc
size A4; Organization: ORGANIZATION; Address1: ADDRESS 1; Address2: ADDRESS 2; Address3: ADDRESS 3; Address4: ADDRESS 4; Revision: -; SheetNumber: 6; SheetTotal: 11; ENG_APP_DATE: --/--/--; DSN_APP_DATE: --/--/--; CHK_APP_DATE: --/--/--
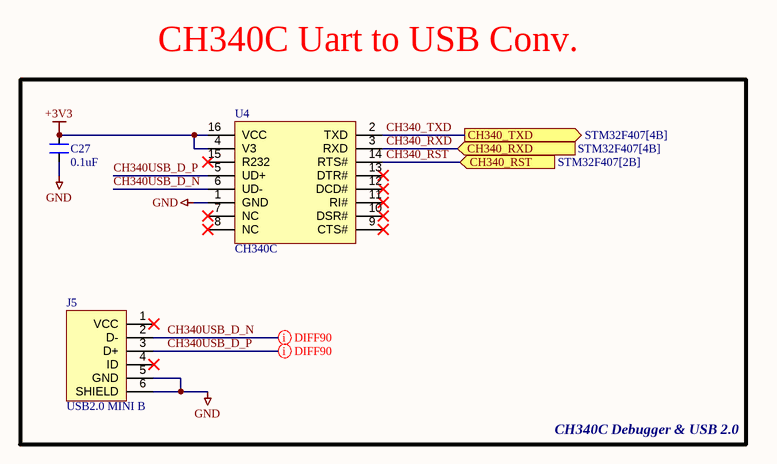
[diagram p5: UART to TTL.SchDoc]

### Parts
C27  0.1uF  [CAP_0805]
J5  USB2.0 MINI B  [CON_690-005-299-043]
U4  CH340C  [SOIC16_50_284_25X90_SMT]

### Blocks framed on the sheet
CH340C Uart to USB Conv.: C27 J5 U4

### Ports
CH340_RST (in, see STM32F407[2B]), CH340_RXD (in, see STM32F407[4B]), CH340_TXD (out, see STM32F407[4B])

### Nets
+3V3: C27.2 U4.4(V3) U4.16(VCC)
GND: C27.1 J5.5(GND) J5.6(SHIELD) U4.1(GND)
CH340_RST: U4.14(RTS#) ; port CH340_RST
CH340_RXD: U4.3(RXD) ; port CH340_RXD
CH340_TXD: U4.2(TXD) ; port CH340_TXD
CH340USB_D_N: J5.2(D-) U4.6(UD-)
CH340USB_D_P: J5.3(D+) U4.5(UD+)

Not connected (* = marked no-connect by the designer): J5 1(VCC)* 4(ID)*; U4 7(NC)* 8(NC)* 9(CTS#)* 10(DSR#)* 11(RI#)* 12(DCD#)* 13(DTR#)* 15(R232)*

### Layout directives
differential pair; differential pair class DIFF90: CH340USB_D_N, CH340USB_D_P

### Notes on the sheet
- CH340C Debugger & USB 2.0
- DWG. NO.
- REV.
- SHT.
- THIS DOCUMENT AND THE DATA DISCLOSED HEREIN OR HEREWITH IS THE PROPERTY OF ALTIUM LIMITED AND MAY BE FREELY DISTRIBUTED IN WHOLE. NO RIGHTS ARE RESERVED OR EXPRESS OR IMPLIED WARANTEE GIVEN.
- REVISION
- DESCRIPTION
- DATE
- APPROVED
- ENG:
- APPROVALS
- PROJECT
- DSN:
- CHK:
- REFERENCE DOCUMENTS
- PROJECT REVISION:
- TITLE
- DOCUMENT REVISION:
- DESIGN ITEM:
- BOM:
- FAB DWG:
- PCB DWG:
- ASSY DWG:
- SCALE:
- SIZE
- B
- CAGE CODE
- FILE NAME
- DWG NO.
- SHEET
- OF
- REV

### Library data of the parts
C27 = CAP_0.1uF-50V-5%-0805: as C13 on sheet Ethernet PHY; Case/Package: 0805; Supplier-1: SIRICOM; Supplier Part Number-1: 0805B104J500CT
J5 = CON_USB2.0-MINIB-SMD: as J1 on sheet STM32F103; Case/Package: USB-MINI-B; Supplier-1: LCSC; Supplier Part Number-1: C105424
U4 = IC_CH340C: USB Bridge, USB to UART USB 2.0 UART Interface; Manufacturer: Olimex; Alternate Part Number-1: NA; Manufacturer Part Number: CH340C; Case/Package: SOIC16; Supplier-1: LCSC; Supplier Part Number-1: C84681

## Sheet ADC.SchDoc
size A4; Organization: ORGANIZATION; Address1: ADDRESS 1; Address2: ADDRESS 2; Address3: ADDRESS 3; Address4: ADDRESS 4; Revision: -; SheetNumber: 7; SheetTotal: 11; ENG_APP_DATE: --/--/--; DSN_APP_DATE: --/--/--; CHK_APP_DATE: --/--/--
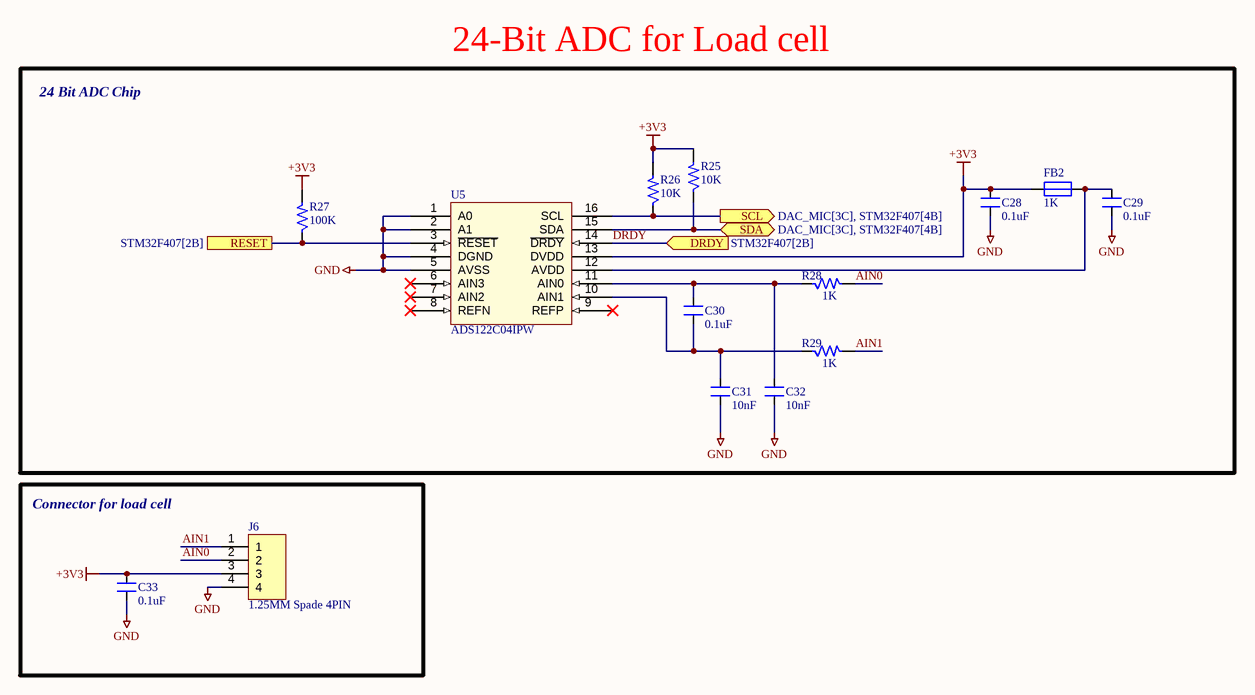
[diagram p6: ADC.SchDoc]

### Parts
C28  0.1uF  [CAP_0805]
C29  0.1uF  [CAP_0805]
C30  0.1uF  [CAP_0805]
C31  10nF  [CAP_0805]
C32  10nF  [CAP_0805]
C33  0.1uF  [CAP_0805]
FB2  1K  [IND_0805]
J6  1.25MM Spade 4PIN  [CON4_50_653004117322_TH_RA]
R25  10K  [RES_0603]
R26  10K  [RES_0603]
R27  100K  [RES_0603]
R28  1K  [RES_0603]
R29  1K  [RES_0603]
U5  ADS122C04IPW  [TSSOP16_25-59_294_54X14_SMT]

### Blocks framed on the sheet
24-Bit ADC for Load cell: C28-C32 FB2 R25-R29 U5
Connector for load cell: C33 J6

### Ports
DRDY (in, see STM32F407[2B]), RESET (see STM32F407[2B]), SCL (out, see DAC_MIC[3C], STM32F407[4B]), SDA (bidir, see DAC_MIC[3C], STM32F407[4B])

### Nets
+3V3: C28.2 C33.2 FB2.1 J6.3 R25.2 R26.2 R27.2 U5.13(DVDD)
GND: C28.1 C29.1 C31.2 C32.2 C33.1 J6.4 U5.1(A0) U5.2(A1) U5.4(DGND) U5.5(AVSS)
AIN0: J6.2 R28.2
AIN1: J6.1 R29.2
DRDY: U5.14(~{DRDY}) ; port DRDY
RESET: R27.1 U5.3(~{RESET}) ; port RESET
SCL: R26.1 U5.16(SCL) ; port SCL
SDA: R25.1 U5.15(SDA) ; port SDA
NetC29_2: C29.2 FB2.2 U5.12(AVDD)
NetC30_1: C30.1 C31.1 R29.1 U5.10(AIN1)
NetC30_2: C30.2 C32.1 R28.1 U5.11(AIN0)

Not connected (* = marked no-connect by the designer): U5 6(AIN3)* 7(AIN2)* 8(REFN)* 9(REFP)*

### Notes on the sheet
- 24 Bit ADC Chip
- DWG. NO.
- REV.
- SHT.
- THIS DOCUMENT AND THE DATA DISCLOSED HEREIN OR HEREWITH IS THE PROPERTY OF ALTIUM LIMITED AND MAY BE FREELY DISTRIBUTED IN WHOLE. NO RIGHTS ARE RESERVED OR EXPRESS OR IMPLIED WARANTEE GIVEN.
- REVISION
- DESCRIPTION
- DATE
- APPROVED
- ENG:
- APPROVALS
- PROJECT
- DSN:
- CHK:
- REFERENCE DOCUMENTS
- PROJECT REVISION:
- TITLE
- DOCUMENT REVISION:
- DESIGN ITEM:
- BOM:
- FAB DWG:
- PCB DWG:
- ASSY DWG:
- SCALE:
- SIZE
- B
- CAGE CODE
- FILE NAME
- DWG NO.
- SHEET
- OF
- REV

### Library data of the parts
C28-C30 C33 = CAP_0.1uF-50V-5%-0805: as C13 on sheet Ethernet PHY; Case/Package: 0805; Supplier-1: SIRICOM; Supplier Part Number-1: 0805B104J500CT
C31 C32 = CAP_10nF-50V-10%-0805: as C8 on sheet STM32F103; Case/Package: 0805; Supplier-1: SIRICOM; Supplier Part Number-1: 0805B103K500CT
FB2 = FB_1K-100MHZ-1.6A-0805: as FB1 on sheet Ethernet PHY; Case/Package: 0805; Supplier-1: SIRICOM; Supplier Part Number-1: ACMS201209A102
J6 = CON-PLG_4X1-50-RA-TH: 4 Pins, 1 Row 1.25mm Pitch, right angle Connector, male; Manufacturer Part Number: 653004117322; Manufacturer: JST; Mating Part Number: 653004113322; Crimp Part Number: 653153128130; Alternate Part Number-1: NA; Case/Package: TH-CON; Supplier-1: WURTH; Supplier Part Number-1: 653004117322
R25 R26 = RES_10K-0.1W-1%-0603: as R8 on sheet Ethernet PHY; Case/Package: 0603; Supplier-1: SIRICOM; Supplier Part Number-1: WR06X1002FTL
R27 = RES_100K-0.1W-1%-0603: as R3 on sheet STM32F103; Case/Package: 0603; Supplier-1: Arrow; Supplier Part Number-1: RMCF0603FT100K
R28 R29 = RES_1K-0.1W-1%-0603: 1 kOhms ±1% 0.1W, 1/10W Chip Resistor 0603 (1608 Metric) Automotive AEC-Q200 Thick Film; Manufacturer: Walsin; Manufacturer Part Number: WR06X1001FTL; Alternate Part Number-1: 0603WAF1001T5E; Case/Package: 0603; Supplier-1: SIRICOM; Supplier Part Number-1: WR06X1001FTL
U5 = IC_ADS122C04IPW: 24 Bit Analog to Digital Converter 4 Input 1 Sigma-Delta 16-TSSOP; Manufacturer: Texas Instruments; Alternate Part Number-1: NA; Manufacturer Part Number: ADS122C04IPW; Case/Package: TSSOP16; Supplier-1: MOUSER; Supplier Part Number-1: ADS122C04IPW

## Sheet DAC_MIC.SchDoc
size A4; Organization: ORGANIZATION; Address1: ADDRESS 1; Address2: ADDRESS 2; Address3: ADDRESS 3; Address4: ADDRESS 4; Revision: -; SheetNumber: 8; SheetTotal: 11; ENG_APP_DATE: --/--/--; DSN_APP_DATE: --/--/--; CHK_APP_DATE: --/--/--
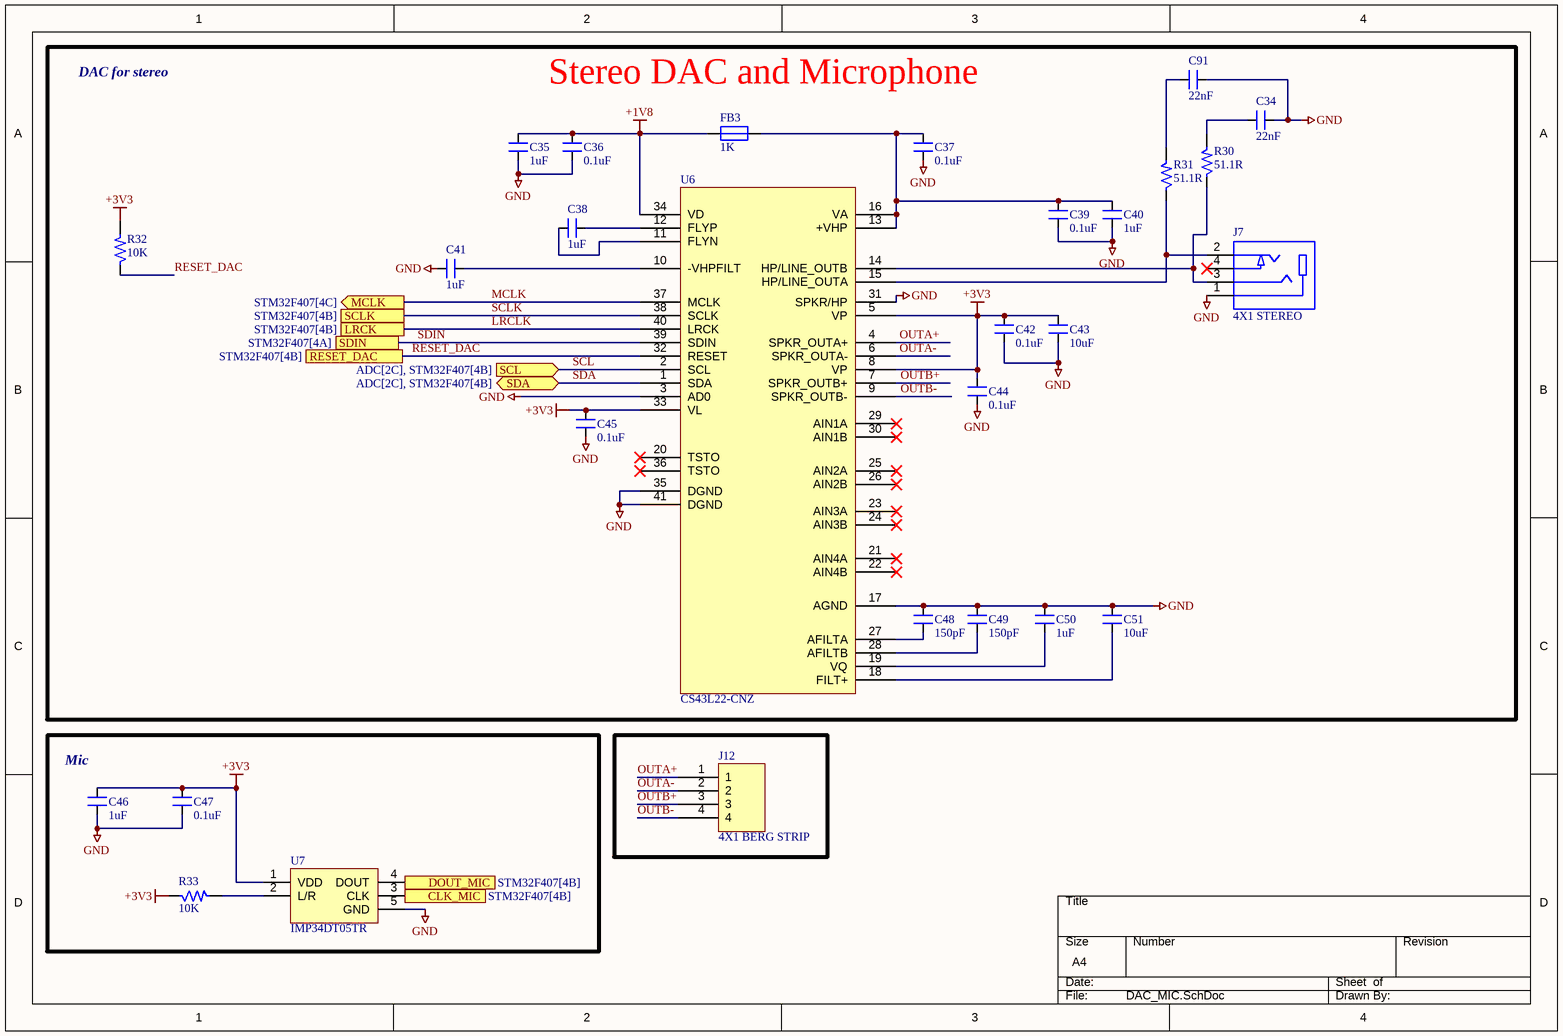
[diagram p7: DAC_MIC.SchDoc]

### Parts
C34  22nF  [CAP_0805]
C35  1uF  [CAP_0805]
C36  0.1uF  [CAP_0805]
C37  0.1uF  [CAP_0805]
C38  1uF  [CAP_0805]
C39  0.1uF  [CAP_0805]
C40  1uF  [CAP_0805]
C41  1uF  [CAP_0805]
C42  0.1uF  [CAP_0805]
C43  10uF  [CAP_1206]
C44  0.1uF  [CAP_0805]
C45  0.1uF  [CAP_0805]
C46  1uF  [CAP_0805]
C47  0.1uF  [CAP_0805]
C48  150pF  [CAP_0805]
C49  150pF  [CAP_0805]
C50  1uF  [CAP_0805]
C51  10uF  [CAP_1206]
C91  22nF  [CAP_0805]
FB3  1K  [IND_0805]
J7  4X1 STEREO  [CON_SJ-2504A-SMT-TR_SMD]
J12  4X1 BERG STRIP  [CON4_100_40D72_TH_ST_MALE]
R30  51.1R  [RES_0603]
R31  51.1R  [RES_0603]
R32  10K  [RES_0603]
R33  10K  [RES_0603]
U6  CS43L22-CNZ  [QFN40_19_284_33X9_SMD]
U7  IMP34DT05TR  [HCLGA-4_53_137_15X37_SMD]

### Blocks framed on the sheet
Stereo DAC and Microphone: C34-C45 C48-C51 C91 FB3 J7 R30-R32 U6
Mic: C46 C47 R33 U7

### Ports
CLK_MIC (in, see STM32F407[4B]), DOUT_MIC (out, see STM32F407[4B]), LRCK (see STM32F407[4B]), MCLK (out, see STM32F407[4C]), RESET_DAC (see STM32F407[4B]), SCL (in, see ADC[2C], STM32F407[4B]), SCLK (see STM32F407[4B]), SDA (bidir, see ADC[2C], STM32F407[4B]), SDIN (see STM32F407[4A])

### Nets
+1V8: C35.2 C36.2 FB3.1 U6.34(VD)
+3V3: C42.2 C43.2 C44.2 C45.2 C46.1 C47.2 R32.2 R33.1 U6.5(VP) U6.8(VP) U6.33(VL) U7.1(VDD)
GND: C34.2 C35.1 C36.1 C37.1 C39.1 C40.2 C41.1 C42.1 C43.1 C44.1 C45.1 C46.2 C47.1 C48.2 C49.2 C50.2 C51.2 C91.2 J7.1 U6.3(AD0) U6.17(AGND) U6.31(SPKR/HP) U6.35(DGND) U6.41(DGND) U7.5(GND)
CLK_MIC: U7.3(CLK) ; port CLK_MIC
DOUT_MIC: U7.4(DOUT) ; port DOUT_MIC
LRCLK: U6.40(LRCK) ; port LRCK  [project net LRCK]
MCLK: U6.37(MCLK) ; port MCLK
OUTA+: J12.1 U6.4(SPKR_OUTA+)
OUTA-: J12.2 U6.6(SPKR_OUTA-)
OUTB+: J12.3 U6.7(SPKR_OUTB+)
OUTB-: J12.4 U6.9(SPKR_OUTB-)
RESET_DAC: R32.1 U6.32(RESET) ; port RESET_DAC
SCL: U6.2(SCL) ; port SCL
SCLK: U6.38(SCLK) ; port SCLK
SDA: U6.1(SDA) ; port SDA
SDIN: U6.39(SDIN) ; port SDIN
NetC34_1: C34.1 R30.2
NetC37_2: C37.2 C39.2 C40.1 FB3.2 U6.13(+VHP) U6.16(VA)
NetC38_1: C38.1 U6.12(FLYP)
NetC38_2: C38.2 U6.11(FLYN)
NetC41_2: C41.2 U6.10(-VHPFILT)
NetC48_1: C48.1 U6.27(AFILTA)
NetC49_1: C49.1 U6.28(AFILTB)
NetC50_1: C50.1 U6.19(VQ)
NetC51_1: C51.1 U6.18(FILT+)
NetC91_1: C91.1 R31.2
NetJ7_2: J7.2 R31.1 U6.15(HP/LINE_OUTA)
NetJ7_3: J7.3 R30.1 U6.14(HP/LINE_OUTB)
NetR33_2: R33.2 U7.2(L/R)

Not connected (* = marked no-connect by the designer): J7 4*; U6 20(TSTO)* 21(AIN4A)* 22(AIN4B)* 23(AIN3A)* 24(AIN3B)* 25(AIN2A)* 26(AIN2B)* 29(AIN1A)* 30(AIN1B)* 36(TSTO)*

### Notes on the sheet
- DAC for stereo
- DWG. NO.
- REV.
- SHT.
- THIS DOCUMENT AND THE DATA DISCLOSED HEREIN OR HEREWITH IS THE PROPERTY OF ALTIUM LIMITED AND MAY BE FREELY DISTRIBUTED IN WHOLE. NO RIGHTS ARE RESERVED OR EXPRESS OR IMPLIED WARANTEE GIVEN.
- REVISION
- DESCRIPTION
- DATE
- APPROVED
- ENG:
- APPROVALS
- PROJECT
- DSN:
- CHK:
- REFERENCE DOCUMENTS
- PROJECT REVISION:
- TITLE
- DOCUMENT REVISION:
- DESIGN ITEM:
- BOM:
- FAB DWG:
- PCB DWG:
- ASSY DWG:
- SCALE:
- SIZE
- B
- CAGE CODE
- FILE NAME
- DWG NO.
- SHEET
- OF
- REV

### Library data of the parts
C34 C91 = CAP_22nF-50V-10%-0805: 0.022µF ±10% 50V Ceramic Capacitor X7R 0805 (2012 Metric); Manufacturer: Samsung Electro-Mechanics; Manufacturer Part Number: CL21B223KBANNNC; Alternate Part Number-1: NA; Case/Package: 0805; Supplier-1: Digikey; Supplier Part Number-1: 1276-1081-1-ND - Cut Tape (CT)
C35 C38 C40 C41 C46 C50 = CAP_1uF-50V-5%-0805: as C7 on sheet STM32F103; Case/Package: 0805; Supplier-1: SIRICOM; Supplier Part Number-1: CL21B105KBFNNNE
C36 C37 C39 C42 C44 C45 C47 = CAP_0.1uF-50V-5%-0805: as C13 on sheet Ethernet PHY; Case/Package: 0805; Supplier-1: SIRICOM; Supplier Part Number-1: 0805B104J500CT
C43 C51 = CAP_10uF-50V-10%-1206: as C11 on sheet Ethernet PHY; Case/Package: 1206; Supplier-1: SIRICOM; Supplier Part Number-1: CC1206KKX5R9BB106
C48 C49 = CAP_150pF-50V-10%-0805: 150pF ±10% 50V Ceramic Capacitor C0G, NP0 0805 (2012 Metric); Manufacturer: AVX Corporation; Manufacturer Part Number: 08055A151KAT2A; Alternate Part Number-1: NA; Case/Package: 0805; Supplier-1: Digikey; Supplier Part Number-1: 478-10501-1-ND - Cut Tape (CT)
FB3 = FB_1K-100MHZ-1.6A-0805: as FB1 on sheet Ethernet PHY; Case/Package: 0805; Supplier-1: SIRICOM; Supplier Part Number-1: ACMS201209A102
J7 = CON-PLG-STEREO_4X1-100-RA-SMD: 2.50mm (0.094", 3/32", Sub Mini, Miniature) - Headphone Phone Jack Stereo (4 Conductor, TRRS) Connector Solder; Manufacturer: CUI Devices; Manufacturer Part Number: SJ-2504A-SMT-TR; Alternate Part Number-1: NA; Case/Package: SMD; Supplier Part Number-1: CP-SJ-2504A-SMT-CT-ND - Cut Tape (CT); Supplier-1: Digikey
J12 = CON-BS-PLG_4X1-100-ST-TH: 4 Pins, 1 Row 2.54mm Pitch, Straight bergstrip, Male; Manufacturer: NA; Manufacturer Part Number: NA; Case/Package: TH-CON; Supplier-1: SP ROAD; Supplier Part Number-1: NA; Alternate Part Number-1: NA
R30 R31 = RES_51.1R-0.1W-1%-0603: 51.1 Ohms ±1% 0.1W, 1/10W Chip Resistor 0603 (1608 Metric) Thick Film; Manufacturer: Vishay Dale; Manufacturer Part Number: CRCW060351R1FKEAC; Alternate Part Number-1: NA; Case/Package: 0603; Supplier-1: Digikey; Supplier Part Number-1: 541-5468-1-ND - Cut Tape (CT)
R32 R33 = RES_10K-0.1W-1%-0603: as R8 on sheet Ethernet PHY; Case/Package: 0603; Supplier-1: SIRICOM; Supplier Part Number-1: WR06X1002FTL
U6 = IC_CS43L22: Audio D/A Converter ICs Low Power Stereo DAC w/ClassD Spkr Driver; Manufacturer: Cirrus Logic; Alternate Part Number-1: NA; Manufacturer Part Number: CS43L22-CNZ; Case/Package: QFN-40; Supplier-1: Mouser; Supplier Part Number-1: 777-CS43L22-CNZ
U7 = IC_IMP34DT05TR: MEMS Microphones AUTO & INDUSTRIAL SENSORS; Manufacturer: STMicroelectronics; Alternate Part Number-1: NA; Manufacturer Part Number: IMP34DT05TR; Case/Package: HCLGA-4; Supplier-1: Mouser; Supplier Part Number-1: 511-IMP34DT05TR

## Sheet Motor Driver_2.SchDoc
size A4; Organization: ORGANIZATION; Address1: ADDRESS 1; Address2: ADDRESS 2; Address3: ADDRESS 3; Address4: ADDRESS 4; Revision: -; SheetNumber: 9; SheetTotal: 11; ENG_APP_DATE: --/--/--; DSN_APP_DATE: --/--/--; CHK_APP_DATE: --/--/--
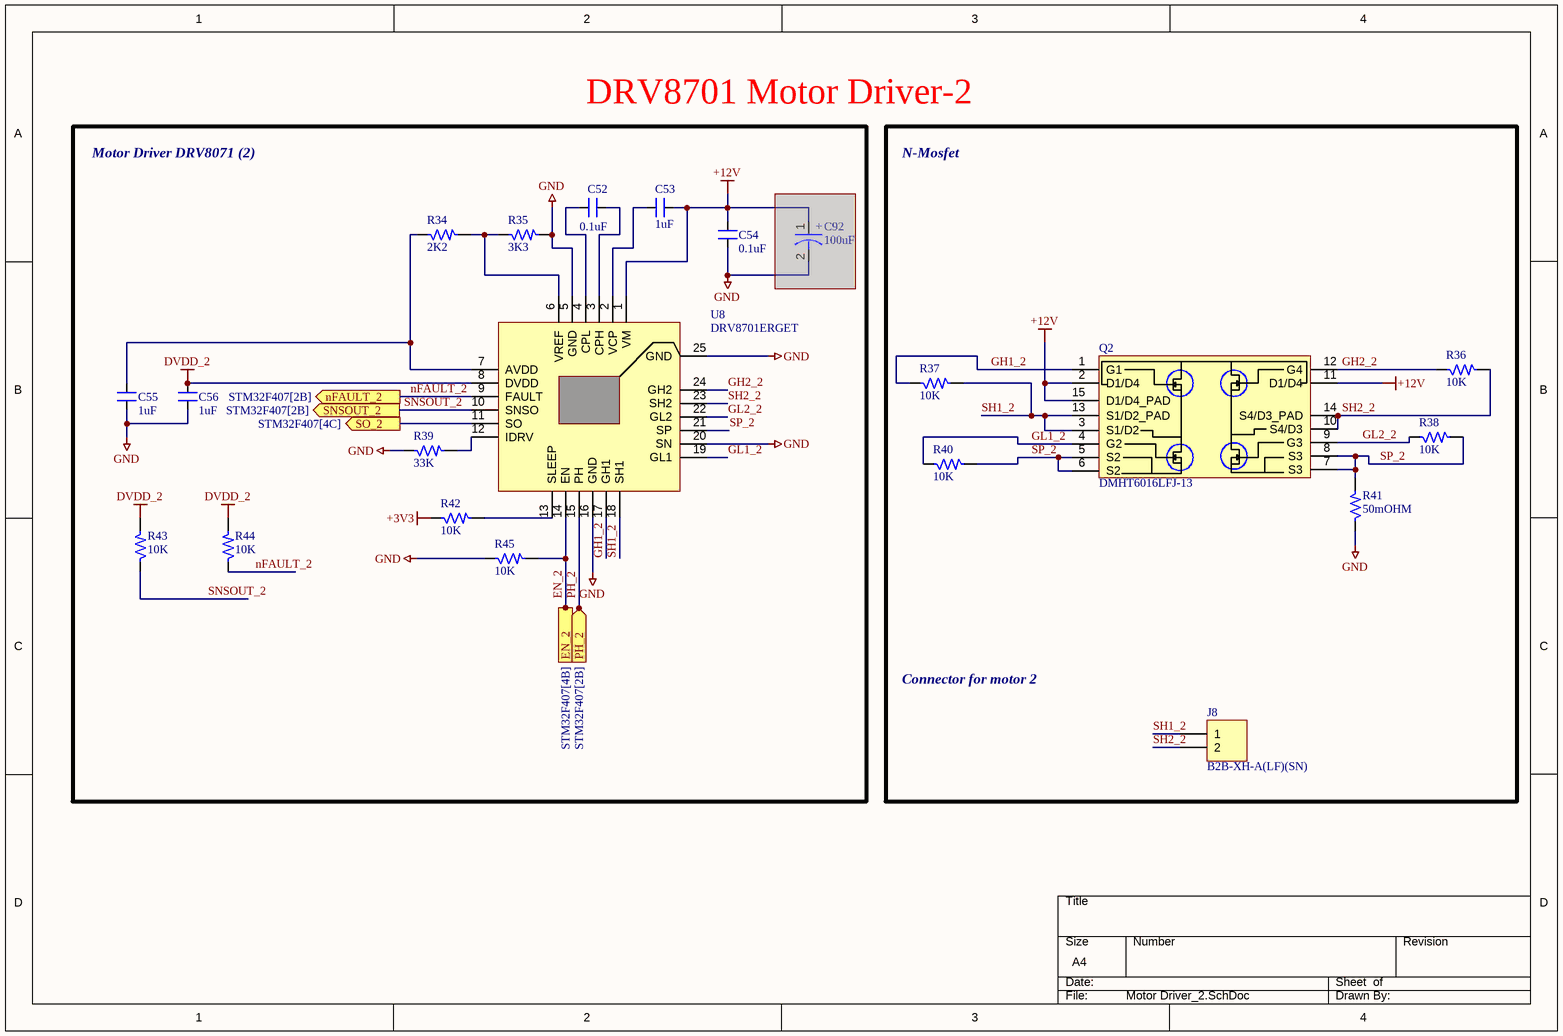
[diagram p8: Motor Driver_2.SchDoc]

### Parts
C52  0.1uF  [CAP_0805]
C53  1uF  [CAP_0805]
C54  0.1uF  [CAP_0805]
C55  1uF  [CAP_0805]
C56  1uF  [CAP_0805]
C92  100uF  [ACAP_P305_D393_H393_RAD]  (masked out: inside a compile mask, not in the netlist)
J8  B2B-XH-A(LF)(SN)  [CON2_100_B2B-XH-A_TH_ST]
Q2  DMHT6016LFJ-13  [DFN5045-12_33_212_27X15_SMD_1]
R34  2K2  [RES_0603]
R35  3K3  [RES_0603]
R36  10K  [RES_0603]
R37  10K  [RES_0603]
R38  10K  [RES_0603]
R39  33K  [RES_0805]
R40  10K  [RES_0603]
R41  50mOHM  [RES_2512]
R42  10K  [RES_0603]
R43  10K  [RES_0603]
R44  10K  [RES_0603]
R45  10K  [RES_0603]
U8  DRV8701ERGET  [VFQFN24_19.6_196_12X32_SMD_1]

### Blocks framed on the sheet
DRV8701 Motor Driver-2: C52-C56 C92 R34 R35 R39 R42-R45 U8

### Ports
EN_2 (in, see STM32F407[4B]), nFAULT_2 (out, see STM32F407[2B]), PH_2 (in, see STM32F407[2B]), SNSOUT_2 (out, see STM32F407[2B]), SO_2 (out, see STM32F407[4C])

### Nets
+3V3: R42.1
+12V: C53.2 C54.2 Q2.2(D1/D4) Q2.11(D1/D4) Q2.15(D1/D4_PAD) U8.1(VM)
DVDD_2: C56.2 R43.2 R44.2 U8.8(DVDD)
GND: C54.1 C55.1 C56.1 R35.2 R39.1 R41.1 R45.1 U8.5(GND) U8.16(GND) U8.20(SN) U8.25(GND)
EN_2: R45.2 U8.14(EN) ; port EN_2
GH1_2: Q2.1(G1) R37.1 U8.17(GH1)
GH2_2: Q2.12(G4) R36.1 U8.24(GH2)
GL1_2: Q2.4(G2) R40.1 U8.19(GL1)
GL2_2: Q2.9(G3) R38.1 U8.22(GL2)
nFAULT_2: R44.1 U8.9(FAULT) ; port nFAULT_2
PH_2: U8.15(PH) ; port PH_2
SH1_2: J8.1 Q2.3(S1/D2) Q2.13(S1/D2_PAD) R37.2 U8.18(SH1)
SH2_2: J8.2 Q2.10(S4/D3) Q2.14(S4/D3_PAD) R36.2 U8.23(SH2)
SNSOUT_2: R43.1 U8.10(SNSO) ; port SNSOUT_2
SO_2: U8.11(SO) ; port SO_2
SP_2: Q2.5(S2) Q2.6(S2) Q2.7(S3) Q2.8(S3) R38.2 R40.2 R41.2 U8.21(SP)
NetC52_1: C52.1 U8.3(CPH)
NetC52_2: C52.2 U8.4(CPL)
NetC53_1: C53.1 U8.2(VCP)
NetC55_2: C55.2 R34.1 U8.7(AVDD)
NetR34_2: R34.2 R35.1 U8.6(VREF)
NetR39_2: R39.2 U8.12(IDRV)
NetR42_2: R42.2 U8.13(SLEEP)

### Notes on the sheet
- Motor Driver DRV8071 (2)
- N-Mosfet
- Connector for motor 2
- DWG. NO.
- REV.
- SHT.
- THIS DOCUMENT AND THE DATA DISCLOSED HEREIN OR HEREWITH IS THE PROPERTY OF ALTIUM LIMITED AND MAY BE FREELY DISTRIBUTED IN WHOLE. NO RIGHTS ARE RESERVED OR EXPRESS OR IMPLIED WARANTEE GIVEN.
- REVISION
- DESCRIPTION
- DATE
- APPROVED
- ENG:
- APPROVALS
- PROJECT
- DSN:
- CHK:
- REFERENCE DOCUMENTS
- PROJECT REVISION:
- TITLE
- DOCUMENT REVISION:
- DESIGN ITEM:
- BOM:
- FAB DWG:
- PCB DWG:
- ASSY DWG:
- SCALE:
- SIZE
- B
- CAGE CODE
- FILE NAME
- DWG NO.
- SHEET
- OF
- REV
- (in symbol CAP-P_100uF-50V-20%-RAD) +

### Library data of the parts
C52 C54 = CAP_0.1uF-50V-5%-0805: as C13 on sheet Ethernet PHY; Case/Package: 0805; Supplier-1: SIRICOM; Supplier Part Number-1: 0805B104J500CT
C53 C55 C56 = CAP_1uF-50V-5%-0805: as C7 on sheet STM32F103; Case/Package: 0805; Supplier-1: SIRICOM; Supplier Part Number-1: CL21B105KBFNNNE
C92 = CAP-P_100uF-50V-20%-RAD: as C90 on sheet Motor Driver; Case/Package: Radial-SMD; Supplier-1: SP ROAD; Supplier Part Number-1: GYA1H101MCQ1GS
J8 = CON-PLG_2X1-100-ST-TH: as J4 on sheet Motor Driver; Manufacturer Part Number: B2B-XH-A(LF)(SN); Case/Package: TH-CON; Supplier-1: SP ROAD; Supplier Part Number-1: B2B-XH-A(LF)(SN)
Q2 = MOSFET-N_60V-14.8A-V-DFN5045-12: as Q1 on sheet Motor Driver; Manufacturer Part Number: DMHT6016LFJ-13; Case/Package: DFN5045-12; Supplier-1: LCSC; Supplier Part Number-1: C460986
R34 = RES_2K2-0.1W-5%-0603: as R13 on sheet Motor Driver; Case/Package: 0603; Supplier-1: SIRICOM; Supplier Part Number-1: WR06X2201FTL
R35 = RES_3.3K-0.1W-1%-0603: as R5 on sheet Ethernet PHY; Case/Package: 0603; Supplier-1: SIRICOM; Supplier Part Number-1: WR06X3301FTL
R36-R38 R40 R42-R45 = RES_10K-0.1W-1%-0603: as R8 on sheet Ethernet PHY; Case/Package: 0603; Supplier-1: SIRICOM; Supplier Part Number-1: WR06X1002FTL
R39 = RES_33K-0.125W-1%-0805: as R18 on sheet Motor Driver; Case/Package: 0805; Supplier-1: SIRICOM; Supplier Part Number-1: WR08X3302FTL
R41 = RES_50mOhm-2W-1%-2512: as R20 on sheet Motor Driver; Case/Package: 2512; Supplier-1: SIRICOM; Supplier Part Number-1: LR2512-22R060F1
U8 = IC_DRV8701ERGET: as U3 on sheet Motor Driver; Manufacturer Part Number: DRV8701ERGET; Case/Package: VFQFN24; Supplier-1: ARROW; Supplier Part Number-1: DRV8701ERGET

## Sheet STM32F407.SchDoc
size A3; Organization: ORGANIZATION; Address1: ADDRESS 1; Address2: ADDRESS 2; Address3: ADDRESS 3; Address4: ADDRESS 4; Revision: -; SheetNumber: 10; SheetTotal: 11; ENG_APP_DATE: --/--/--; DSN_APP_DATE: --/--/--; CHK_APP_DATE: --/--/--
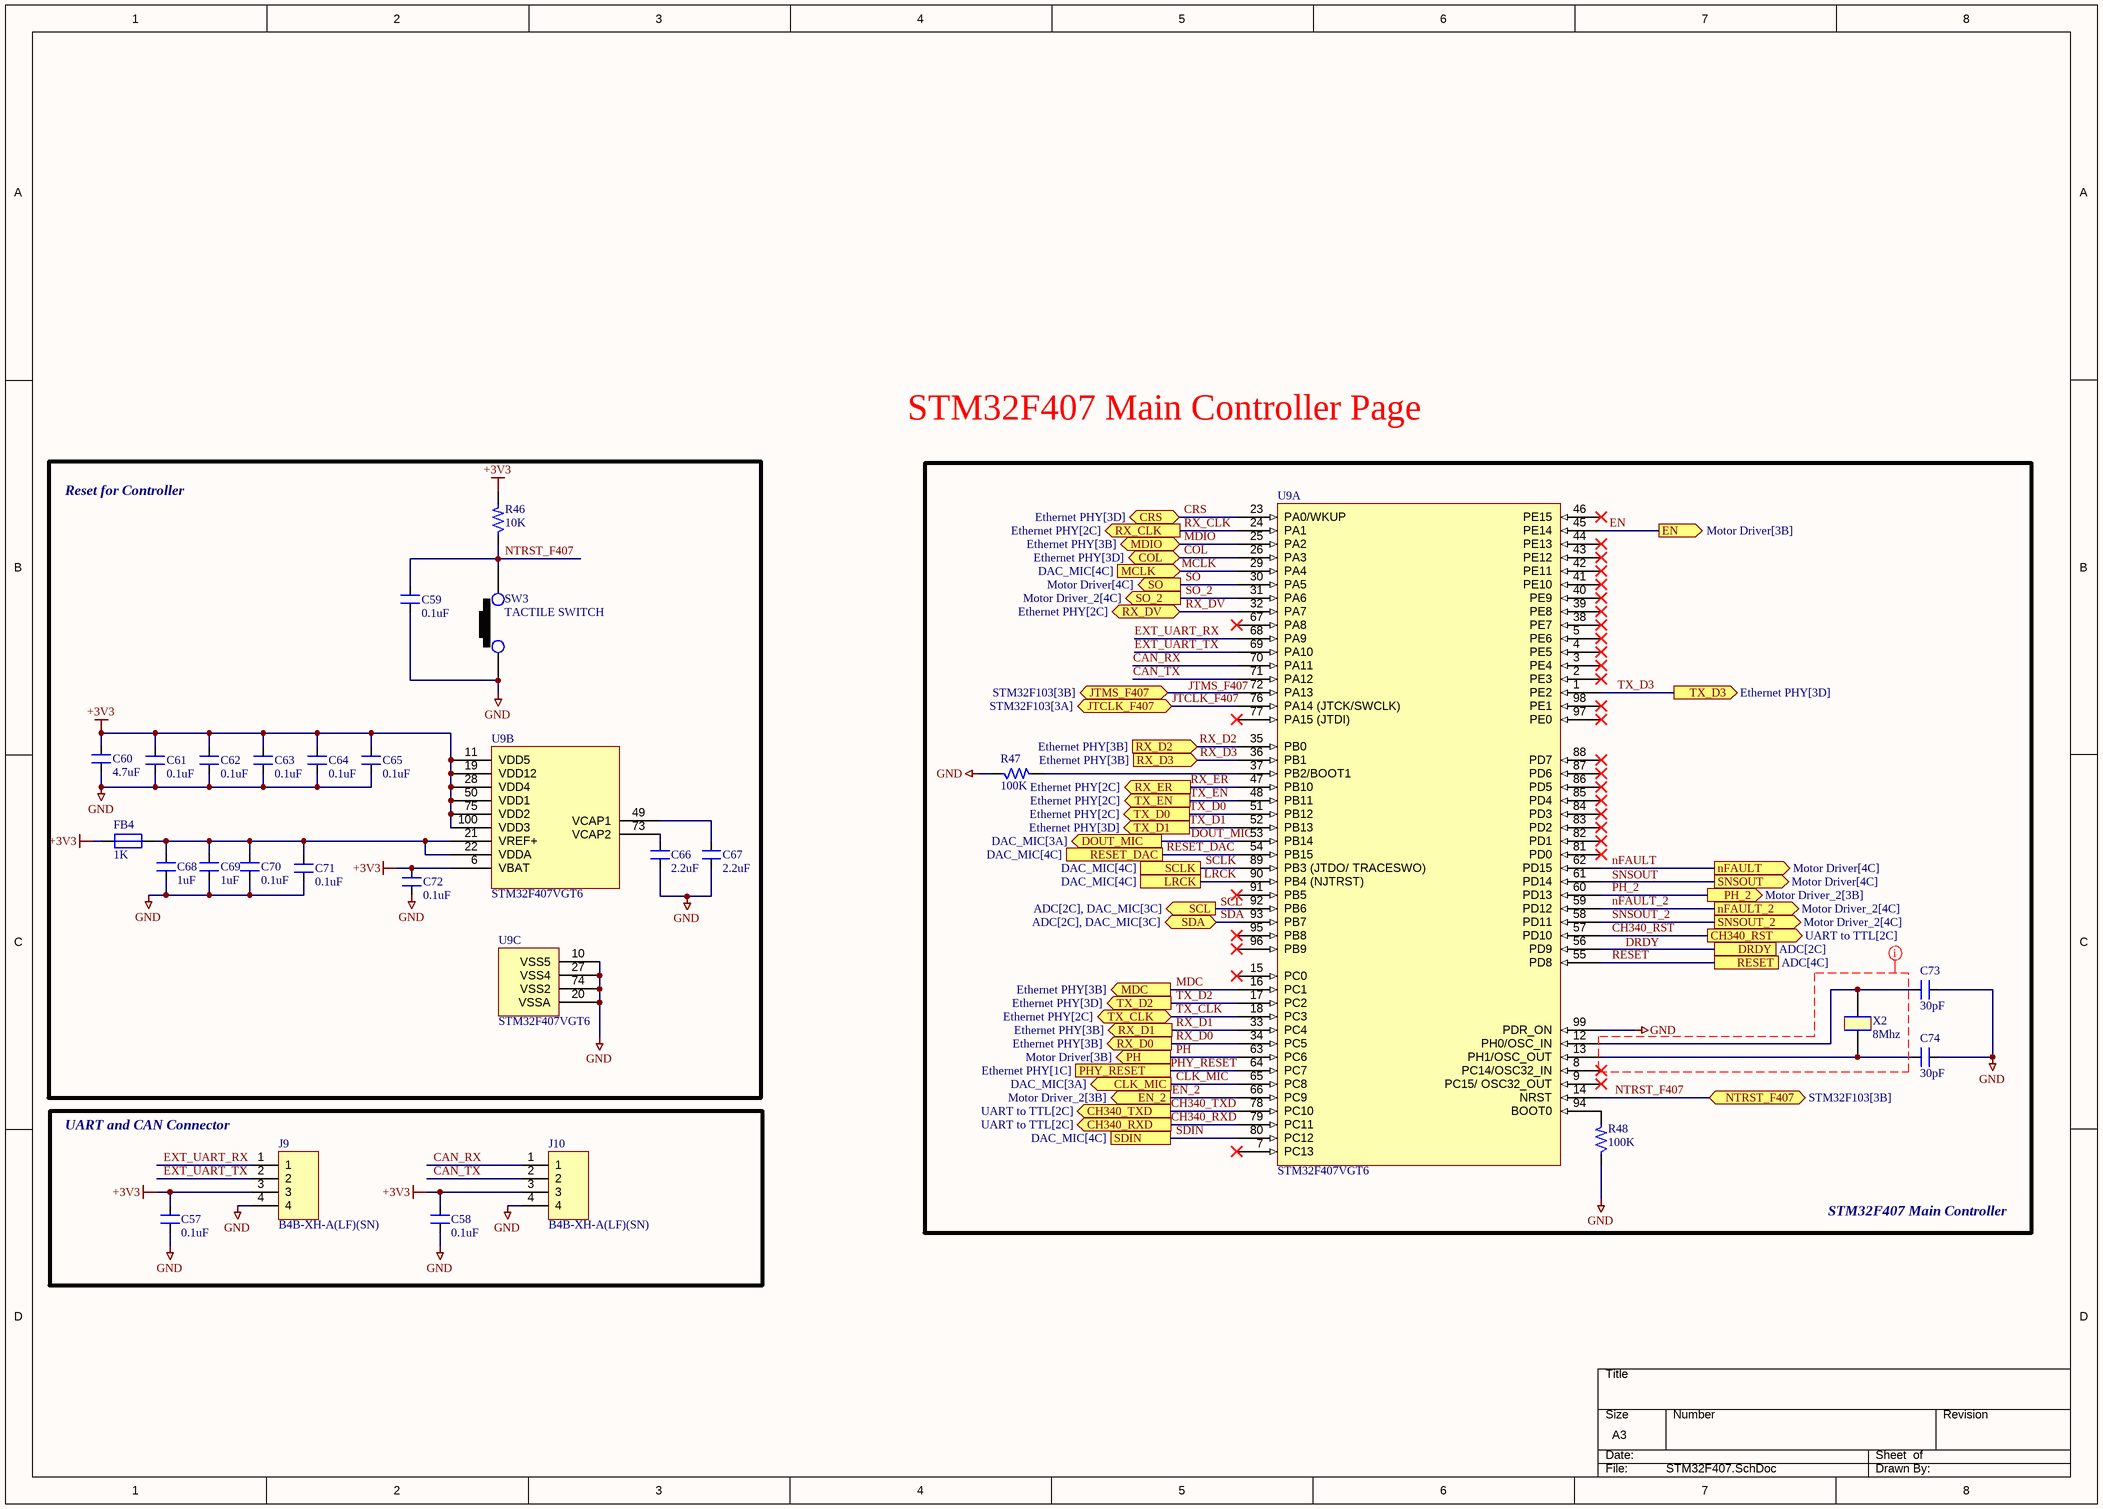
[diagram p9: STM32F407.SchDoc]

### Parts
C57  0.1uF  [CAP_0805]
C58  0.1uF  [CAP_0805]
C59  0.1uF  [CAP_0805]
C60  4.7uF  [CAP_0805]
C61  0.1uF  [CAP_0805]
C62  0.1uF  [CAP_0805]
C63  0.1uF  [CAP_0805]
C64  0.1uF  [CAP_0805]
C65  0.1uF  [CAP_0805]
C66  2.2uF  [CAP_0805]
C67  2.2uF  [CAP_0805]
C68  1uF  [CAP_0805]
C69  1uF  [CAP_0805]
C70  0.1uF  [CAP_0805]
C71  0.1uF  [CAP_0805]
C72  0.1uF  [CAP_0805]
C73  30pF  [CAP_0805]
C74  30pF  [CAP_0805]
FB4  1K  [IND_0805]
J9  B4B-XH-A(LF)(SN)  [CON4_100_B4B-XH-A_TH_ST]
J10  B4B-XH-A(LF)(SN)  [CON4_100_B4B-XH-A_TH_ST]
R46  10K  [RES_0603]
R47  100K  [RES_0603]
R48  100K  [RES_0603]
SW3  TACTILE SWITCH  [SW_342_SMD]
U9  STM32F407VGT6  [QFN100_19.6_669_58X10_SMD]  (parts A,B,C of 3)
X2  8Mhz  [XTAL_314_240X47_SMD]

### Blocks framed on the sheet
Reset for Controller: C59-C72 FB4 R46 SW3 U9
STM32F407 Main Controller: C73 C74 R47 R48 U9 X2
UART and CAN Connector: C57 C58 J9 J10

### Ports
CH340_RST (out, see UART to TTL[2C]), CH340_RXD (out, see UART to TTL[2C]), CH340_TXD (out, see UART to TTL[2C]), CLK_MIC (out, see DAC_MIC[3A]), COL (bidir, see Ethernet PHY[3D]), CRS (bidir, see Ethernet PHY[3D]), DOUT_MIC (out, see DAC_MIC[3A]), DRDY (see ADC[2C]), EN (out, see Motor Driver[3B]), EN_2 (out, see Motor Driver_2[3B]), JTCLK_F407 (bidir, see STM32F103[3A]), JTMS_F407 (bidir, see STM32F103[3B]), LRCK (see DAC_MIC[4C]), MCLK (in, see DAC_MIC[4C]), MDC (out, see Ethernet PHY[3B]), MDIO (bidir, see Ethernet PHY[3B]), nFAULT (out, see Motor Driver[4C]), nFAULT_2 (out, see Motor Driver_2[4C]), NTRST_F407 (bidir, see STM32F103[3B]), PH (out, see Motor Driver[3B]), PH_2 (out, see Motor Driver_2[3B]), PHY_RESET (see Ethernet PHY[1C]), RESET (see ADC[4C]), RESET_DAC (see DAC_MIC[4C]), RX_CLK (out, see Ethernet PHY[2C]), RX_D0 (out, see Ethernet PHY[3B]), RX_D1 (out, see Ethernet PHY[3B]), RX_D2 (in, see Ethernet PHY[3B]), RX_D3 (in, see Ethernet PHY[3B]), RX_DV (bidir, see Ethernet PHY[2C]), RX_ER (out, see Ethernet PHY[2C]), SCL (out, see ADC[2C], DAC_MIC[3C]), SCLK (see DAC_MIC[4C]), SDA (bidir, see ADC[2C], DAC_MIC[3C]), SDIN (see DAC_MIC[4C]), SNSOUT (out, see Motor Driver[4C]), SNSOUT_2 (out, see Motor Driver_2[4C]), SO (out, see Motor Driver[4C]), SO_2 (out, see Motor Driver_2[4C]), TX_CLK (bidir, see Ethernet PHY[2C]), TX_D0 (out, see Ethernet PHY[2C]), TX_D1 (out, see Ethernet PHY[3D]), TX_D2 (out, see Ethernet PHY[3D]), TX_D3 (out, see Ethernet PHY[3D]), TX_EN (out, see Ethernet PHY[2C])

### Nets
+3V3: C57.2 C58.2 C60.2 C61.2 C62.2 C63.2 C64.2 C65.2 C72.2 FB4.1 J9.3 J10.3 R46.2 U9.6(VBAT) U9.11(VDD5) U9.19(VDD12) U9.28(VDD4) U9.50(VDD1) U9.75(VDD2) U9.100(VDD3)
GND: C57.1 C58.1 C59.1 C60.1 C61.1 C62.1 C63.1 C64.1 C65.1 C66.1 C67.1 C68.1 C69.1 C70.1 C71.1 C72.1 C73.2 C74.2 J9.4 J10.4 R47.1 R48.1 SW3.1 U9.10(VSS5) U9.20(VSSA) U9.27(VSS4) U9.74(VSS2) U9.99(PDR_ON)
CAN_RX: J10.1 U9.70(PA11)
CAN_TX: J10.2 U9.71(PA12)
CH340_RST: U9.57(PD10) ; port CH340_RST
CH340_RXD: U9.79(PC11) ; port CH340_RXD
CH340_TXD: U9.78(PC10) ; port CH340_TXD
CLK_MIC: U9.65(PC8) ; port CLK_MIC
COL: U9.26(PA3) ; port COL
CRS: U9.23(PA0/WKUP) ; port CRS
DOUT_MIC: U9.53(PB14) ; port DOUT_MIC
DRDY: U9.56(PD9) ; port DRDY
EN: U9.45(PE14) ; port EN
EN_2: U9.66(PC9) ; port EN_2
EXT_UART_RX: J9.1 U9.68(PA9)
EXT_UART_TX: J9.2 U9.69(PA10)
JTCLK_F407: U9.76(PA14_(JTCK/SWCLK)) ; port JTCLK_F407
LRCK: U9.90(PB4_(NJTRST)) ; port LRCK
MCLK: U9.29(PA4) ; port MCLK
MDC: U9.16(PC1) ; port MDC
MDIO: U9.25(PA2) ; port MDIO
nFAULT: U9.62(PD15) ; port nFAULT
nFAULT_2: U9.59(PD12) ; port nFAULT_2
NTRST_F407: C59.2 R46.1 SW3.2 U9.14(NRST) ; port NTRST_F407
PH: U9.63(PC6) ; port PH
PH_2: U9.60(PD13) ; port PH_2
PHY_RESET: U9.64(PC7) ; port PHY_RESET
RESET: U9.55(PD8) ; port RESET
RESET_DAC: U9.54(PB15) ; port RESET_DAC
RX_CLK: U9.24(PA1) ; port RX_CLK
RX_D0: U9.34(PC5) ; port RX_D0
RX_D1: U9.33(PC4) ; port RX_D1
RX_D2: U9.35(PB0) ; port RX_D2
RX_D3: U9.36(PB1) ; port RX_D3
RX_DV: U9.32(PA7) ; port RX_DV
RX_ER: U9.47(PB10) ; port RX_ER
SCL: U9.92(PB6) ; port SCL
SCLK: U9.89(PB3_(JTDO/_TRACESWO)) ; port SCLK
SDA: U9.93(PB7) ; port SDA
SDIN: U9.80(PC12) ; port SDIN
SNSOUT: U9.61(PD14) ; port SNSOUT
SNSOUT_2: U9.58(PD11) ; port SNSOUT_2
SO: U9.30(PA5) ; port SO
SO_2: U9.31(PA6) ; port SO_2
TX_CLK: U9.18(PC3) ; port TX_CLK
TX_D0: U9.51(PB12) ; port TX_D0
TX_D1: U9.52(PB13) ; port TX_D1
TX_D2: U9.17(PC2) ; port TX_D2
TX_D3: U9.1(PE2) ; port TX_D3
TX_EN: U9.48(PB11) ; port TX_EN
NetC66_2: C66.2 U9.73(VCAP2)
NetC67_2: C67.2 U9.49(VCAP1)
NetC68_2: C68.2 C69.2 C70.2 C71.2 FB4.2 U9.21(VREF+) U9.22(VDDA)
NetC73_1: C73.1 U9.12(PH0/OSC_IN) X2.2
NetC74_1: C74.1 U9.13(PH1/OSC_OUT) X2.1
NetR47_2: R47.2 U9.37(PB2/BOOT1)
NetR48_2: R48.2 U9.94(BOOT0)
NetU1_25: U9.72(PA13) ; port JTMS_F407

Not connected (* = marked no-connect by the designer): U9 2(PE3)* 3(PE4)* 4(PE5)* 5(PE6)* 7(PC13)* 8(PC14/OSC32_IN)* 9(PC15/_OSC32_OUT)* 15(PC0)* 38(PE7)* 39(PE8)* 40(PE9)* 41(PE10)* 42(PE11)* 43(PE12)* 44(PE13)* 46(PE15)* 67(PA8)* 77(PA15_(JTDI))* 81(PD0)* 82(PD1)* 83(PD2)* 84(PD3)* 85(PD4)* 86(PD5)* 87(PD6)* 88(PD7)* 91(PB5)* 95(PB8)* 96(PB9)* 97(PE0)* 98(PE1)*

### Layout directives
net class OSC_Nets: GND

### Notes on the sheet
- STM32F407 Main Controller Page
- Labels drawn without touching a wire or pin: DRDY, JTMS_F407, SCL, SNSOUT
- DWG. NO.
- REV.
- SHT.
- THIS DOCUMENT AND THE DATA DISCLOSED HEREIN OR HEREWITH IS THE PROPERTY OF ALTIUM LIMITED AND MAY BE FREELY DISTRIBUTED IN WHOLE. NO RIGHTS ARE RESERVED OR EXPRESS OR IMPLIED WARANTEE GIVEN.
- REVISION
- DESCRIPTION
- DATE
- APPROVED
- ENG:
- APPROVALS
- PROJECT
- DSN:
- CHK:
- REFERENCE DOCUMENTS
- PROJECT REVISION:
- TITLE
- DOCUMENT REVISION:
- DESIGN ITEM:
- BOM:
- FAB DWG:
- PCB DWG:
- ASSY DWG:
- SCALE:
- SIZE
- B
- CAGE CODE
- FILE NAME
- DWG NO.
- SHEET
- OF
- REV

### Library data of the parts
C57 C58 = CAP_0.1uF-50V-10%-0805: as C2 on sheet STM32F103; Case/Package: 0805; Supplier-1: SIRICOM; Supplier Part Number-1: 0805B104K500CT
C59 C61-C65 C70-C72 = CAP_0.1uF-50V-20%-0805: 0.1µF ±20% 50V Ceramic Capacitor X7R 0805 (2012 Metric); Manufacturer: Samsung Electro-Mechanics; Manufacturer Part Number: CL21B104MBCNNNC; Alternate Part Number-1: NA; Case/Package: 0805; Supplier-1: SIRICOM; Supplier Part Number-1: 0805B104K500CT
C60 = CAP_4.7uF-50V-10%-0805: as C1 on sheet STM32F103; Case/Package: 0805; Supplier-1: SIRICOM; Supplier Part Number-1: CL21A475KBQNNNE
C66 C67 = CAP_2.2uF-25V-10%-0805: 2.2µF ±10% 25V Ceramic Capacitor X7R 0805 (2012 Metric); Manufacturer: KEMET; Manufacturer Part Number: CL21B225KAFNFNE; Alternate Part Number-1: NA; Case/Package: 0805; Supplier-1: SIRICOM; Supplier Part Number-1: CL21A225KAFNNNE
C68 C69 = CAP_1uF-50V-5%-0805: as C7 on sheet STM32F103; Case/Package: 0805; Supplier-1: SIRICOM; Supplier Part Number-1: CL21B105KBFNNNE
C73 C74 = CAP_30pF-50V-10%-0805: as C3 on sheet STM32F103; Case/Package: 0805; Supplier-1: Digikey; Supplier Part Number-1: 399-17443-1-ND - Cut Tape (CT)
FB4 = FB_1K-100MHZ-1.6A-0805: as FB1 on sheet Ethernet PHY; Case/Package: 0805; Supplier-1: SIRICOM; Supplier Part Number-1: ACMS201209A102
J9 J10 = CON-PLG_4X1-100-ST-TH: 4 Pins, 1 Row 2.54mm Pitch, straight Connector, male; Manufacturer: Wurth Electronics; Mating Part Number: XHP-4; Crimp Part Number: ASXHSXH22K51; Alternate Part Number-1: NA; Manufacturer Part Number: B4B-XH-A(LF)(SN); Case/Package: TH-CON; Supplier-1: LCSC; Supplier Part Number-1: B4B-XH-A(LF)(SN)
R46 = RES_10K-0.1W-1%-0603: as R8 on sheet Ethernet PHY; Case/Package: 0603; Supplier-1: SIRICOM; Supplier Part Number-1: WR06X1002FTL
R47 R48 = RES_100K-0.1W-1%-0603: as R3 on sheet STM32F103; Case/Package: 0603; Supplier-1: Arrow; Supplier Part Number-1: RMCF0603FT100K
SW3 = SW1_RS-282G05A3-SMRT-SMD: as SW1 on sheet STM32F103; Manufacturer Part Number: RS-282G05A3-SMRT; Case/Package: SMD; Supplier-1: SP ROAD; Supplier Part Number-1: RS-282G05A3-SMRT
U9 = IC_STM32F407VGT6: ARM® Cortex®-M4 STM32F4 Microcontroller IC 32-Bit 168MHz 1MB (1M x 8) FLASH 100-LQFP (14x14); Manufacturer: STMicroelectronics; Alternate Part Number-1: STM32F407VET6; Manufacturer Part Number: STM32F407VGT6; Case/Package: LQFP100; Supplier-1: ARROW; Supplier Part Number-1: STM32F407VGT6
X2 = XTAL_8MHZ-ECS-80-32-5PX-SMD: as X1 on sheet STM32F103; Case/Package: SMD/SMT; Supplier-1: SP ROAD; Supplier Part Number-1: ECS-80-32-5PX-TR